# Altium project QLA.PrjPCB
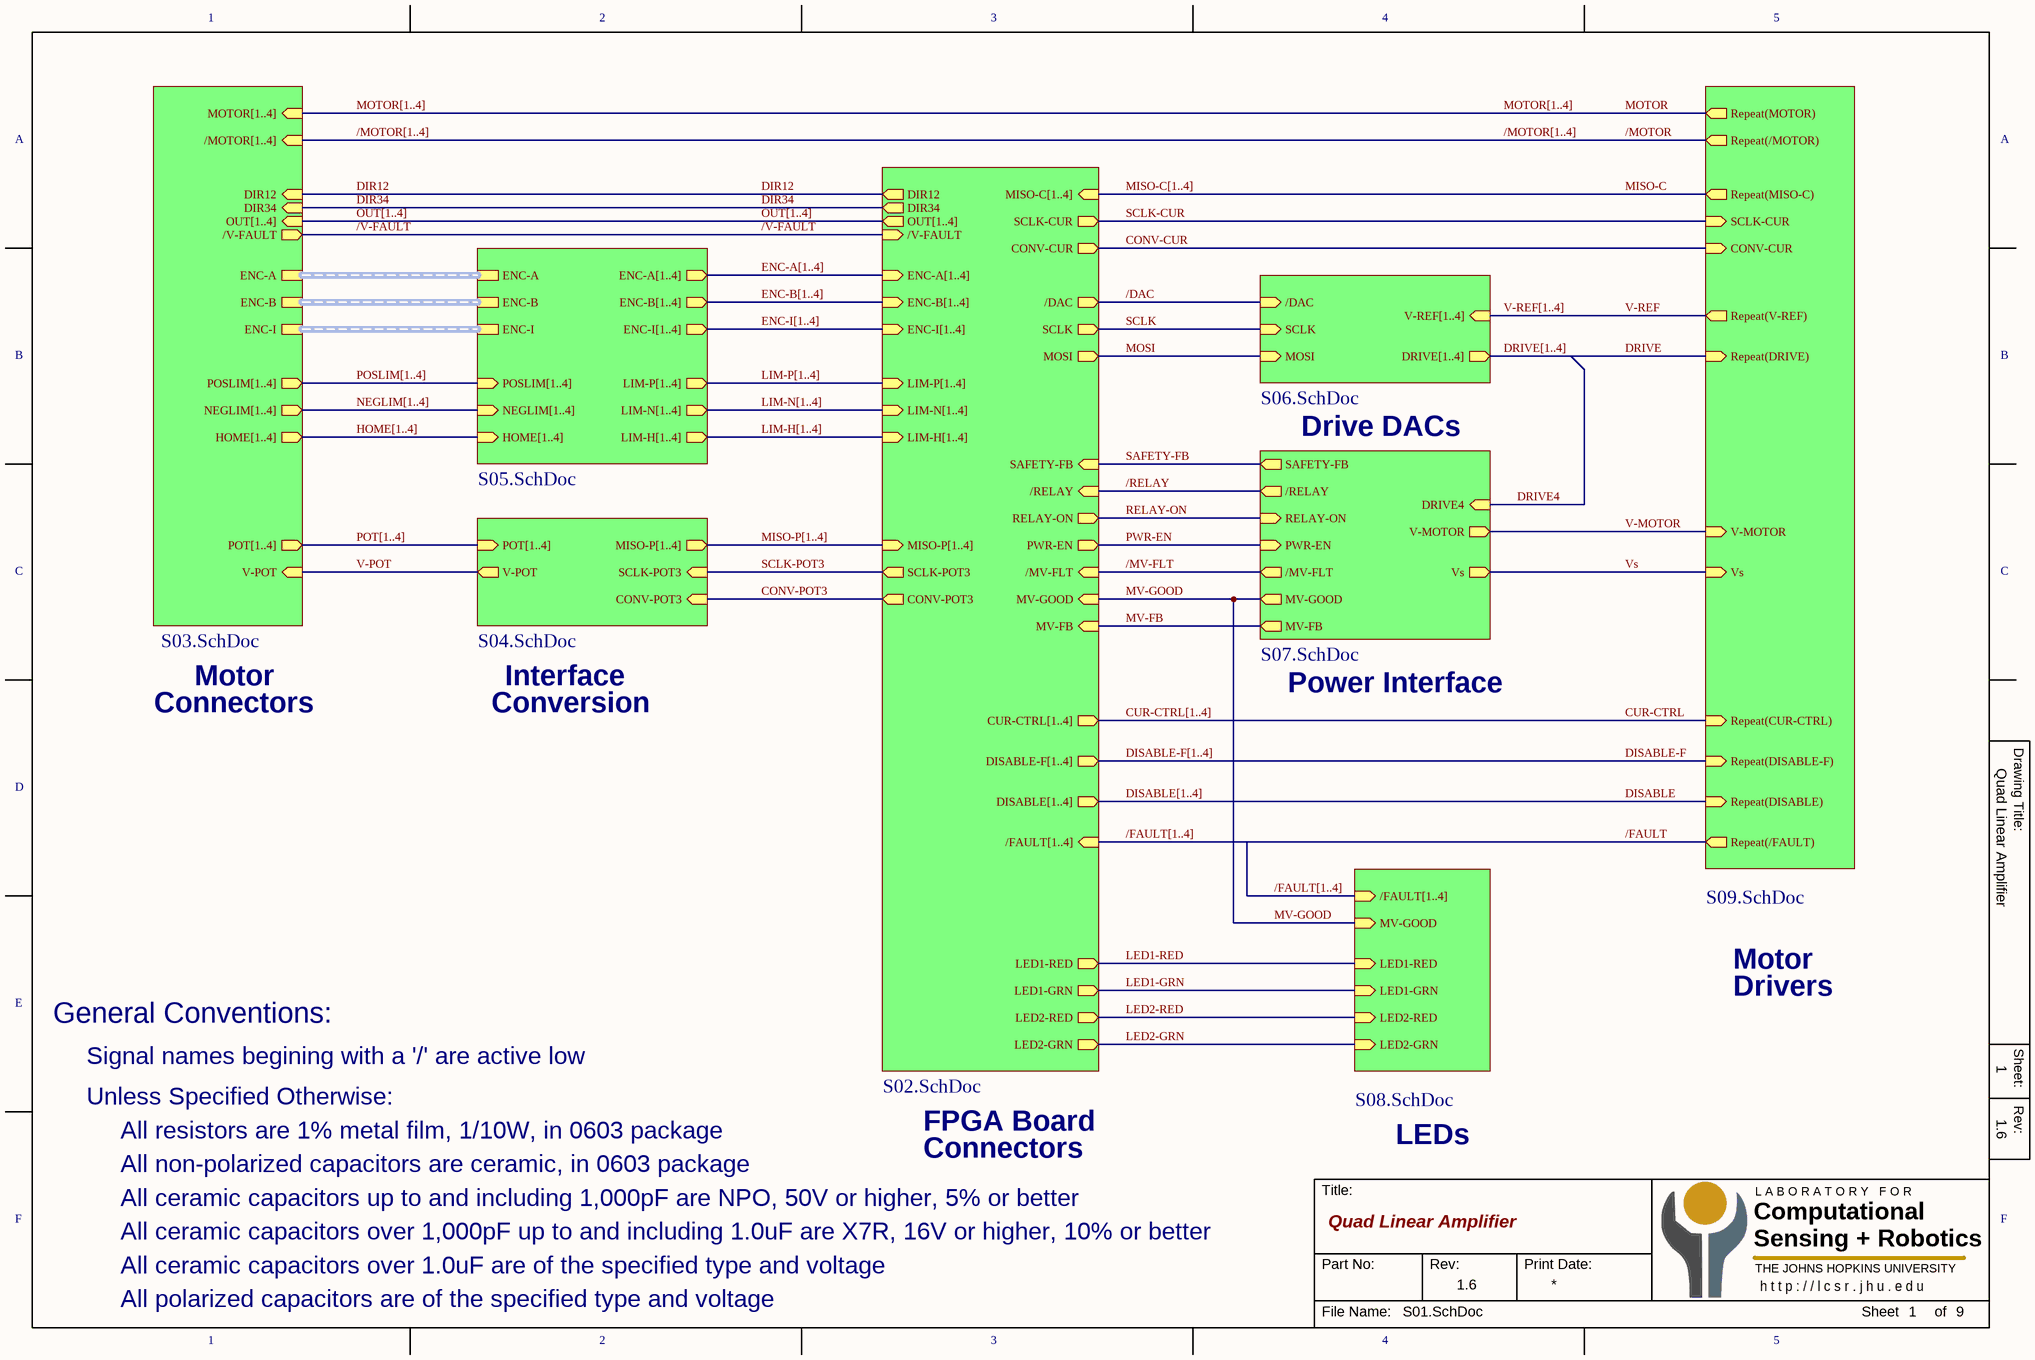
[diagram p0: S01.SchDoc]
9 sheets, 484 parts. Net scope: hierarchical (ports join the sheet entries above them; power ports are global).
Board file: AMP.PcbDoc
Sheets:
  S01.SchDoc
    U_S02 = S02.SchDoc
    U_S03 = S03.SchDoc
    U_S04 = S04.SchDoc
    U_S05 = S05.SchDoc
    U_S06 = S06.SchDoc
    U_S091 = S09.SchDoc
    U_S092 = S09.SchDoc
    U_S093 = S09.SchDoc
    U_S094 = S09.SchDoc
    U_S07 = S07.SchDoc
    U_S09 = S08.SchDoc

## Sheet S01.SchDoc: Quad Linear Amplifier
size 381 x 254 mm; Revision: 1.6; SheetNumber: 1; SheetTotal: 9

### Sub-sheets
Repeat(U_S09,1,4) = S09.SchDoc: Repeat(/MOTOR) (out), Repeat(MOTOR) (out), Repeat(DRIVE) (in), V-MOTOR (in), Repeat(DISABLE) (in), Repeat(/FAULT) (out), CONV-CUR (in), SCLK-CUR (in), Repeat(MISO-C) (out), Repeat(DISABLE-F) (in), Repeat(CUR-CTRL) (in), Vs (in), Repeat(V-REF) (out)
U_S02 = S02.SchDoc: /FAULT[1..4] (in), DISABLE[1..4] (out), LIM-P[1..4] (in), LIM-N[1..4] (in), LIM-H[1..4] (in), ENC-A[1..4] (in), ENC-B[1..4] (in), ENC-I[1..4] (in), OUT[1..4] (out), CONV-POT3 (out), SCLK-POT3 (out), MISO-P[1..4] (in), CONV-CUR (out), SCLK-CUR (out), MISO-C[1..4] (in), PWR-EN (out), MV-GOOD (in), /DAC (out), SCLK (out), MOSI (out), /V-FAULT (in), RELAY-ON (out), /RELAY (in), LED2-GRN (out), LED2-RED (out), LED1-GRN (out), LED1-RED (out), DIR34 (out), DIR12 (out), /MV-FLT (in), CUR-CTRL[1..4] (out), MV-FB (in), SAFETY-FB (in), DISABLE-F[1..4] (out)
U_S03 = S03.SchDoc: OUT[1..4] (in), POSLIM[1..4] (out), NEGLIM[1..4] (out), HOME[1..4] (out), POT[1..4] (out), V-POT (in), /MOTOR[1..4] (in), MOTOR[1..4] (in), ENC-A (harness ENC-A), ENC-B (harness ENC-B), ENC-I (harness ENC-I), /V-FAULT (out), DIR34 (in), DIR12 (in)
U_S04 = S04.SchDoc: CONV-POT3 (in), SCLK-POT3 (in), MISO-P[1..4] (out), V-POT (out), POT[1..4] (in)
U_S05 = S05.SchDoc: ENC-A[1..4] (out), ENC-B[1..4] (out), ENC-I[1..4] (out), ENC-A (harness ENC-A), ENC-B (harness ENC-B), ENC-I (harness ENC-I), POSLIM[1..4] (in), NEGLIM[1..4] (in), HOME[1..4] (in), LIM-P[1..4] (out), LIM-N[1..4] (out), LIM-H[1..4] (out)
U_S06 = S06.SchDoc: DRIVE[1..4] (out), /DAC (in), SCLK (in), MOSI (in), V-REF[1..4] (in)
U_S07 = S07.SchDoc: V-MOTOR (out), PWR-EN (in), MV-GOOD (out), RELAY-ON (in), /RELAY (out), /MV-FLT (out), MV-FB (out), SAFETY-FB (out), Vs (out), DRIVE4 (in)
U_S09 = S08.SchDoc: /FAULT[1..4] (in), MV-GOOD (in), LED2-GRN (in), LED2-RED (in), LED1-GRN (in), LED1-RED (in)

### Nets
/DAC: sheet U_S02//DAC, sheet U_S06//DAC
/FAULT: sheet Repeat(U_S09,1,4)/Repeat(/FAULT)
/MOTOR: sheet Repeat(U_S09,1,4)/Repeat(/MOTOR)
/MV-FLT: sheet U_S02//MV-FLT, sheet U_S07//MV-FLT
/RELAY: sheet U_S02//RELAY, sheet U_S07//RELAY
/V-FAULT: sheet U_S02//V-FAULT, sheet U_S03//V-FAULT
CONV-CUR: sheet U_S02/CONV-CUR, sheet Repeat(U_S09,1,4)/CONV-CUR
CONV-POT3: sheet U_S02/CONV-POT3, sheet U_S04/CONV-POT3
CUR-CTRL: sheet Repeat(U_S09,1,4)/Repeat(CUR-CTRL)
DIR12: sheet U_S02/DIR12, sheet U_S03/DIR12
DIR34: sheet U_S02/DIR34, sheet U_S03/DIR34
DISABLE: sheet Repeat(U_S09,1,4)/Repeat(DISABLE)
DISABLE-F: sheet Repeat(U_S09,1,4)/Repeat(DISABLE-F)
DRIVE: sheet Repeat(U_S09,1,4)/Repeat(DRIVE)
LED1-GRN: sheet U_S02/LED1-GRN, sheet U_S09/LED1-GRN
LED1-RED: sheet U_S02/LED1-RED, sheet U_S09/LED1-RED
LED2-GRN: sheet U_S02/LED2-GRN, sheet U_S09/LED2-GRN
LED2-RED: sheet U_S02/LED2-RED, sheet U_S09/LED2-RED
MISO-C: sheet Repeat(U_S09,1,4)/Repeat(MISO-C)
MOSI: sheet U_S02/MOSI, sheet U_S06/MOSI
MOTOR: sheet Repeat(U_S09,1,4)/Repeat(MOTOR)
MV-FB: sheet U_S02/MV-FB, sheet U_S07/MV-FB
MV-GOOD: sheet U_S02/MV-GOOD, sheet U_S07/MV-GOOD, sheet U_S09/MV-GOOD
PWR-EN: sheet U_S02/PWR-EN, sheet U_S07/PWR-EN
RELAY-ON: sheet U_S02/RELAY-ON, sheet U_S07/RELAY-ON
SAFETY-FB: sheet U_S02/SAFETY-FB, sheet U_S07/SAFETY-FB
SCLK: sheet U_S02/SCLK, sheet U_S06/SCLK
SCLK-CUR: sheet U_S02/SCLK-CUR, sheet Repeat(U_S09,1,4)/SCLK-CUR
SCLK-POT3: sheet U_S02/SCLK-POT3, sheet U_S04/SCLK-POT3
V-MOTOR: sheet Repeat(U_S09,1,4)/V-MOTOR, sheet U_S07/V-MOTOR
V-POT: sheet U_S03/V-POT, sheet U_S04/V-POT
V-REF: sheet Repeat(U_S09,1,4)/Repeat(V-REF)
Vs: sheet Repeat(U_S09,1,4)/Vs, sheet U_S07/Vs

### Buses and harness runs
bus /FAULT[1..4] = sheet U_S02//FAULT[1..4] = sheet U_S09//FAULT[1..4]
bus /MOTOR[1..4] = sheet U_S03//MOTOR[1..4]
bus CUR-CTRL[1..4] = sheet U_S02/CUR-CTRL[1..4]
bus DISABLE-F[1..4] = sheet U_S02/DISABLE-F[1..4]
bus DISABLE[1..4] = sheet U_S02/DISABLE[1..4]
bus DRIVE[1..4] = sheet U_S06/DRIVE[1..4]
bus ENC-A[1..4] = sheet U_S02/ENC-A[1..4] = sheet U_S05/ENC-A[1..4]
bus ENC-B[1..4] = sheet U_S02/ENC-B[1..4] = sheet U_S05/ENC-B[1..4]
bus ENC-I[1..4] = sheet U_S02/ENC-I[1..4] = sheet U_S05/ENC-I[1..4]
bus HOME[1..4] = sheet U_S03/HOME[1..4] = sheet U_S05/HOME[1..4]
bus LIM-H[1..4] = sheet U_S02/LIM-H[1..4] = sheet U_S05/LIM-H[1..4]
bus LIM-N[1..4] = sheet U_S02/LIM-N[1..4] = sheet U_S05/LIM-N[1..4]
bus LIM-P[1..4] = sheet U_S02/LIM-P[1..4] = sheet U_S05/LIM-P[1..4]
bus MISO-C[1..4] = sheet U_S02/MISO-C[1..4]
bus MISO-P[1..4] = sheet U_S02/MISO-P[1..4] = sheet U_S04/MISO-P[1..4]
bus MOTOR[1..4] = sheet U_S03/MOTOR[1..4]
bus NEGLIM[1..4] = sheet U_S03/NEGLIM[1..4] = sheet U_S05/NEGLIM[1..4]
bus OUT[1..4] = sheet U_S02/OUT[1..4] = sheet U_S03/OUT[1..4]
bus POSLIM[1..4] = sheet U_S03/POSLIM[1..4] = sheet U_S05/POSLIM[1..4]
bus POT[1..4] = sheet U_S03/POT[1..4] = sheet U_S04/POT[1..4]
bus V-REF[1..4] = sheet U_S06/V-REF[1..4]
harness sheet U_S03/ENC-A = sheet U_S05/ENC-A
harness sheet U_S03/ENC-B = sheet U_S05/ENC-B
harness sheet U_S03/ENC-I = sheet U_S05/ENC-I

### Notes on the sheet
- Drive DACs
- Motor
- Interface
- Power Interface
- Connectors
- Conversion
- General Conventions:
- Drivers
- Signal names begining with a '/' are active low
- Unless Specified Otherwise:
- All resistors are 1% metal film, 1/10W, in 0603 package
- All non-polarized capacitors are ceramic, in 0603 package
- FPGA Board
- LEDs
- All ceramic capacitors up to and including 1,000pF are NPO, 50V or higher, 5% or better
- All ceramic capacitors over 1,000pF up to and including 1.0uF are X7R, 16V or higher, 10% or better
- All ceramic capacitors over 1.0uF are of the specified type and voltage
- All polarized capacitors are of the specified type and voltage
- 1
- 2
- 3
- 4
- 5
- A
- B
- C
- Drawing Title:
- D
- E
- Sheet:
- Rev:
- F
- Title:
- Computational
- Sensing + Robotics
- L A B O R A T O R Y   F O R
- Part No:
- Print Date:
- THE JOHNS HOPKINS UNIVERSITY
- h t t p : / / l c s r . j h u . e d u
- File Name:
- Sheet
- of

## Sheet S02.SchDoc: Quad Linear Amplifier
size 381 x 254 mm; Revision: 1.6; SheetNumber: 2; SheetTotal: 9; PageSetup: Record=PageOptions|CenterHorizontal=True|CenterVertical=True|PrintScale=0.72|XCorrection=1.00|YCorrection=1.00|PrintKind=1|BorderSize=5000000|LeftOffset=0|BottomOffset=0|Orientation=2|PaperLength=1000|PaperWidth=1000|Scale=100|PaperSource=7|PrintQuality=1200|MediaType=1|DitherType=10|PaperKind=Letter|PrintScaleMode=1
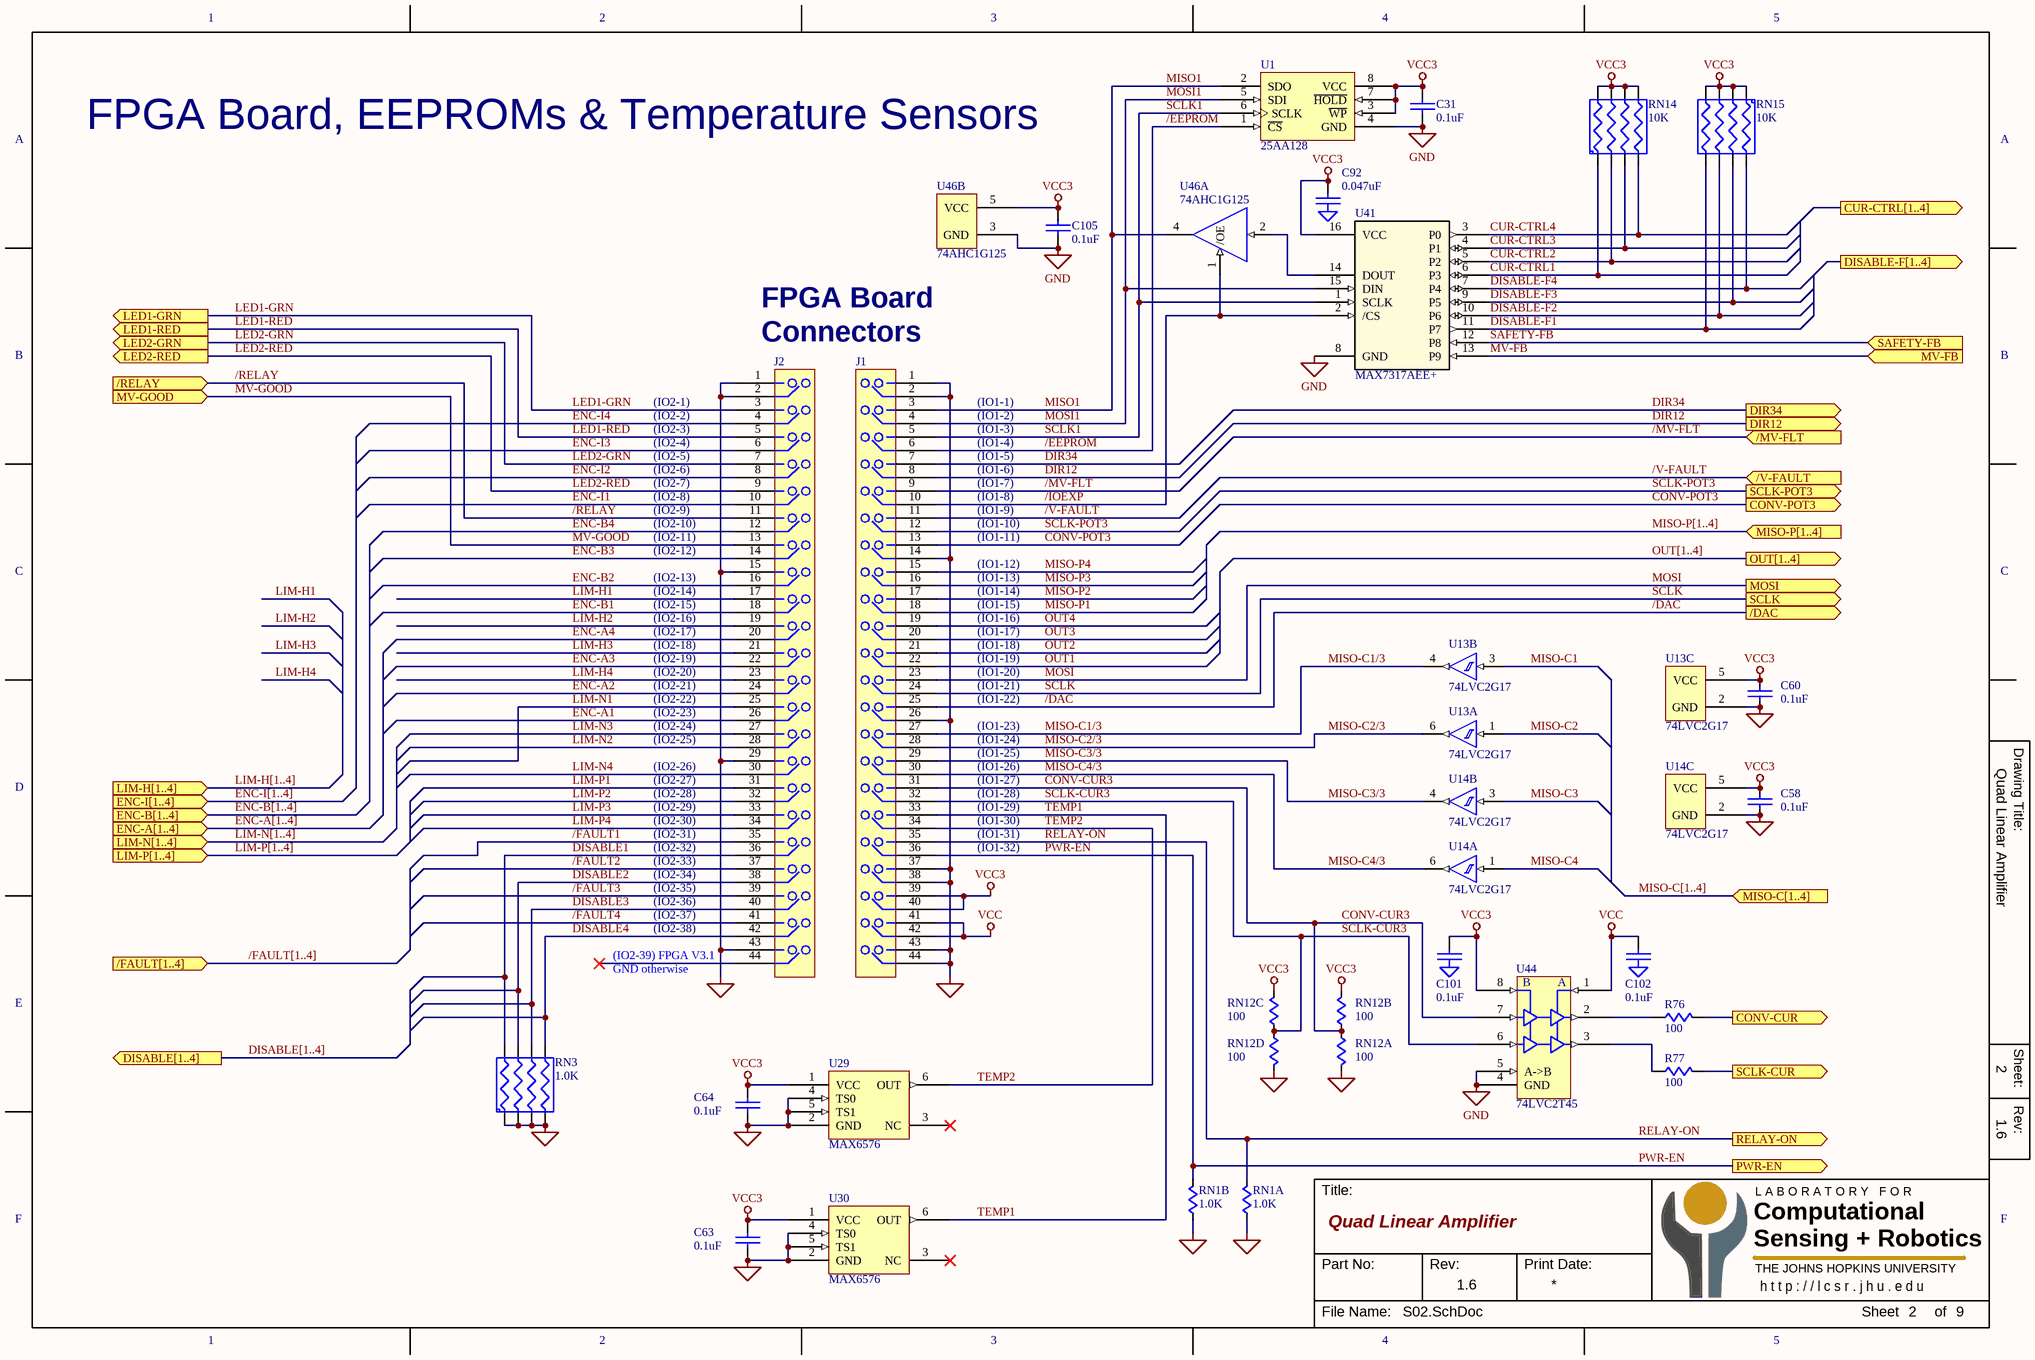
[diagram p1: S02.SchDoc]

### Parts
C31  0.1uF  [C0603]
C58  0.1uF  [C0603]
C60  0.1uF  [C0603]
C63  0.1uF  [C0603]
C64  0.1uF  [C0603]
C92  0.047uF  [C0603]
C101  0.1uF  [C0603]
C102  0.1uF  [C0603]
C105  0.1uF  [C0603]
J1  HEADER 22x2-1  [HDR-22x2-2MM]  (value not drawn)
J2  HEADER 22x2-1  [HDR-22x2-2MM]  (value not drawn)
R76  100  [R0603]
R77  100  [R0603]
RN1  1.0K  [RN-742C083]  (parts A,B of 4)
RN3  1.0K  [RN-742C083]
RN12  100  [RN-742C083]  (parts A,B,C,D of 4)
RN14  10K  [RN-742C083]
RN15  10K  [RN-742C083]
U1  25AA128  [TSSOP-8]
U13  74LVC2G17  [SOT-23-6]  (parts A,B,C of 3)
U14  74LVC2G17  [SOT-23-6]  (parts A,B,C of 3)
U29  MAX6576  [SOT-23-6]
U30  MAX6576  [SOT-23-6]
U41  MAX7317AEE+  [QSOP-16]
U44  74LVC2T45  [US8-8]
U46  74AHC1G125  [SOT-23-5]  (parts A,B of 2)

### Ports
/DAC (out), /FAULT[1..4] (in), /MV-FLT (in), /RELAY (in), /V-FAULT (in), CONV-CUR (out), CONV-POT3 (out), CUR-CTRL[1..4] (out), DIR12 (out), DIR34 (out), DISABLE-F[1..4] (out), DISABLE[1..4] (out), ENC-A[1..4] (in), ENC-B[1..4] (in), ENC-I[1..4] (in), LED1-GRN (out), LED1-RED (out), LED2-GRN (out), LED2-RED (out), LIM-H[1..4] (in), LIM-N[1..4] (in), LIM-P[1..4] (in), MISO-C[1..4] (in), MISO-P[1..4] (in), MOSI (out), MV-FB (in), MV-GOOD (in), OUT[1..4] (out), PWR-EN (out), RELAY-ON (out), SAFETY-FB (in), SCLK (out), SCLK-CUR (out), SCLK-POT3 (out)

### Nets
GND: C31.2 C58.2 C60.2 C63.2 C64.2 C92.2(GND) C101.2(GND) C102.2(GND) C105.2 J1.1 J1.2 J1.14 J1.26 J1.37 J1.38 J1.43 J1.44 J2.1 J2.2 J2.15 J2.29 J2.43 RN1.1 RN1.2 RN3.1(R1) RN3.2(R2.1) RN3.3(R3.1) RN3.4(R4.1) RN12.5 RN12.8 U1.4(GND) U13.2(GND) U14.2(GND) U29.2(GND) U29.4(TS0) U29.5(TS1) U30.2(GND) U30.4(TS0) U30.5(TS1) U41.8(GND) U44.4(GND) U44.5(A->B) U46.3(GND)
VCC: C102.1 J1.41 J1.42 U44.1(VCCA)
VCC3: C31.1 C58.1 C60.1 C63.1 C64.1 C92.1 C101.1 C105.1 J1.39 J1.40 RN12.6 RN12.7 RN14.5(R4.2) RN14.6(R3.2) RN14.7(R2.2) RN14.8(R1.2) RN15.1(R1) RN15.2(R2.1) RN15.3(R3.1) RN15.4(R4.1) U1.3(~{WP}) U1.7(~{HOLD}) U1.8(VCC) U13.5(VCC) U14.5(VCC) U29.1(VCC) U30.1(VCC) U41.16(VCC) U44.8(VCCB) U46.5(VCC)
/DAC: J1.25 ; port /DAC
/EEPROM: J1.6 U1.1(~{CS})
/FAULT1: J2.35  [project net /FAULT]
/FAULT2: J2.37  [project net /FAULT]
/FAULT3: J2.39  [project net /FAULT]
/FAULT4: J2.41  [project net /FAULT]
/IOEXP: J1.10 U41.2(/CS) U46.1(/OE)
/MV-FLT: J1.9 ; port /MV-FLT
/RELAY: J2.11 ; port /RELAY
/V-FAULT: J1.11 ; port /V-FAULT
CONV-CUR: R76.2 ; port CONV-CUR
CONV-CUR3: J1.31 RN12.1 RN12.2 U44.7(B)
CONV-POT3: J1.13 ; port CONV-POT3
CUR-CTRL1: RN14.1(R1) U41.6(P3)
CUR-CTRL2: RN14.2(R2.1) U41.5(P2)
CUR-CTRL3: RN14.3(R3.1) U41.4(P1)
CUR-CTRL4: RN14.4(R4.1) U41.3(P0)
DIR12: J1.8 ; port DIR12
DIR34: J1.7 ; port DIR34
DISABLE1: J2.36 RN3.8(R1.2)  [project net DISABLE]
DISABLE2: J2.38 RN3.7(R2.2)  [project net DISABLE]
DISABLE3: J2.40 RN3.6(R3.2)  [project net DISABLE]
DISABLE4: J2.42 RN3.5(R4.2)  [project net DISABLE]
DISABLE-F1: RN15.5(R4.2) U41.11(P7)
DISABLE-F2: RN15.6(R3.2) U41.10(P6)
DISABLE-F3: RN15.7(R2.2) U41.9(P5)
DISABLE-F4: RN15.8(R1.2) U41.7(P4)
ENC-A1: J2.26
ENC-A2: J2.24
ENC-A3: J2.22
ENC-A4: J2.20
ENC-B1: J2.18
ENC-B2: J2.16
ENC-B3: J2.14
ENC-B4: J2.12
ENC-I1: J2.10
ENC-I2: J2.8
ENC-I3: J2.6
ENC-I4: J2.4
LED1-GRN: J2.3 ; port LED1-GRN
LED1-RED: J2.5 ; port LED1-RED
LED2-GRN: J2.7 ; port LED2-GRN
LED2-RED: J2.9 ; port LED2-RED
LIM-H1: J2.17
LIM-H2: J2.19
LIM-H3: J2.21
LIM-H4: J2.23
LIM-N1: J2.25
LIM-N2: J2.28
LIM-N3: J2.27
LIM-N4: J2.30
LIM-P1: J2.31
LIM-P2: J2.32
LIM-P3: J2.33
LIM-P4: J2.34
MISO1: J1.3 U1.2(SDO) U46.4(Y)
MISO-C1: U13.3  [project net MISO-C]
MISO-C1/3: J1.27 U13.4
MISO-C2: U13.1  [project net MISO-C]
MISO-C2/3: J1.28 U13.6
MISO-C3: U14.3  [project net MISO-C]
MISO-C3/3: J1.29 U14.4
MISO-C4: U14.1  [project net MISO-C]
MISO-C4/3: J1.30 U14.6
MISO-P1: J1.18
MISO-P2: J1.17
MISO-P3: J1.16
MISO-P4: J1.15
MOSI: J1.23 ; port MOSI
MOSI1: J1.4 U1.5(SDI) U41.15(DIN)
MV-FB: U41.13(P9) ; port MV-FB
MV-GOOD: J2.13 ; port MV-GOOD
OUT1: J1.22
OUT2: J1.21
OUT3: J1.20
OUT4: J1.19
PWR-EN: J1.36 RN1.7 ; port PWR-EN
RELAY-ON: J1.35 RN1.8 ; port RELAY-ON
SAFETY-FB: U41.12(P8) ; port SAFETY-FB
SCLK: J1.24 ; port SCLK
SCLK1: J1.5 U1.6(SCLK) U41.1(SCLK)
SCLK-CUR: R77.2 ; port SCLK-CUR
SCLK-CUR3: J1.32 RN12.3 RN12.4 U44.6(B)
SCLK-POT3: J1.12 ; port SCLK-POT3
TEMP1: J1.33 U30.6(OUT)
TEMP2: J1.34 U29.6(OUT)
NetR76_1: R76.1 U44.2(A)
NetR77_1: R77.1 U44.3(A)
NetU41_14: U41.14(DOUT) U46.2(A)

Not connected (* = marked no-connect by the designer): J2 44*; U29 3(NC)*; U30 3(NC)*

### Buses and harness runs
bus /FAULT[1..4] = port /FAULT[1..4]
bus DISABLE[1..4] = port DISABLE[1..4]
bus ENC-A[1..4] = port ENC-A[1..4]
bus ENC-B[1..4] = port ENC-B[1..4]
bus ENC-I[1..4] = port ENC-I[1..4]
bus LIM-H[1..4] = port LIM-H[1..4]
bus LIM-N[1..4] = port LIM-N[1..4]
bus LIM-P[1..4] = port LIM-P[1..4]
bus MISO-C[1..4] = port MISO-C[1..4]
bus MISO-P[1..4] = port MISO-P[1..4]
bus OUT[1..4] = port OUT[1..4]

### Notes on the sheet
- FPGA Board, EEPROMs & Temperature Sensors
- FPGA Board
- Connectors
- (IO2-1)
- (IO2-2)
- (IO2-3)
- (IO1-1)
- (IO1-2)
- (IO1-3)
- (IO2-4)
- (IO2-5)
- (IO2-6)
- (IO2-7)
- (IO2-8)
- (IO1-4)
- (IO1-5)
- (IO1-6)
- (IO1-7)
- (IO1-8)
- (IO2-9)
- (IO2-10)
- (IO2-11)
- (IO2-12)
- (IO1-9)
- (IO1-10)
- (IO1-11)
- (IO1-12)
- (IO2-13)
- (IO2-14)
- (IO2-15)
- (IO2-16)
- (IO2-17)
- (IO1-13)
- (IO1-14)
- (IO1-15)
- (IO1-16)
- (IO1-17)
- (IO2-18)
- (IO2-19)
- (IO2-20)
- (IO2-21)
- (IO2-22)
- (IO1-18)
- (IO1-19)
- (IO1-20)
- (IO1-21)
- (IO1-22)
- (IO2-23)
- (IO2-24)
- (IO2-25)
- (IO2-26)
- (IO1-23)
- (IO1-24)
- (IO1-25)
- (IO1-26)
- (IO2-27)
- (IO2-28)
- (IO2-29)
- (IO2-30)
- (IO2-31)
- (IO1-27)
- (IO1-28)
- (IO1-29)
- (IO1-30)
- (IO1-31)
- (IO2-32)
- (IO2-33)
- (IO2-34)
- (IO2-35)
- (IO2-36)
- (IO1-32)
- (near J2) (IO2-39) FPGA V3.1
- GND otherwise
- (IO2-37)
- (IO2-38)
- 1
- 2
- 3
- 4
- 5
- A
- B
- C
- Drawing Title:
- D
- E
- Sheet:
- Rev:
- F
- Title:
- Computational
- Sensing + Robotics
- L A B O R A T O R Y   F O R
- Part No:
- Print Date:
- THE JOHNS HOPKINS UNIVERSITY
- h t t p : / / l c s r . j h u . e d u
- File Name:
- Sheet
- of

### Library data of the parts
C31 C63 C64 C105 = CAP
C58 C60 = CAP-MINI
C92 C101 C102 = CAP-GND
R76 R77 = R
RN1 RN12 = RN-DISC-SM-4X
RN3 RN14 RN15 = RN-DISC-SM-4
U13 U14 = 2G17: NC7WZ17
U41 = MAX7317AEE+: SourceLibrary: Maxim_2011-10-27; Built_By: EMA_UL_Team; Vendor: Maxim Integrated Products; Revision: 1; Manufacturer_Part_Number: MAX7317AEE+; Copyright: Copyright (C) 2021 Accelerated Designs. All rights reserved; RefDes: RefDes; Type: DEV

## Sheet S03.SchDoc: Quad Linear Amplifier
size 381 x 254 mm; Revision: 1.6; SheetNumber: 3; SheetTotal: 9
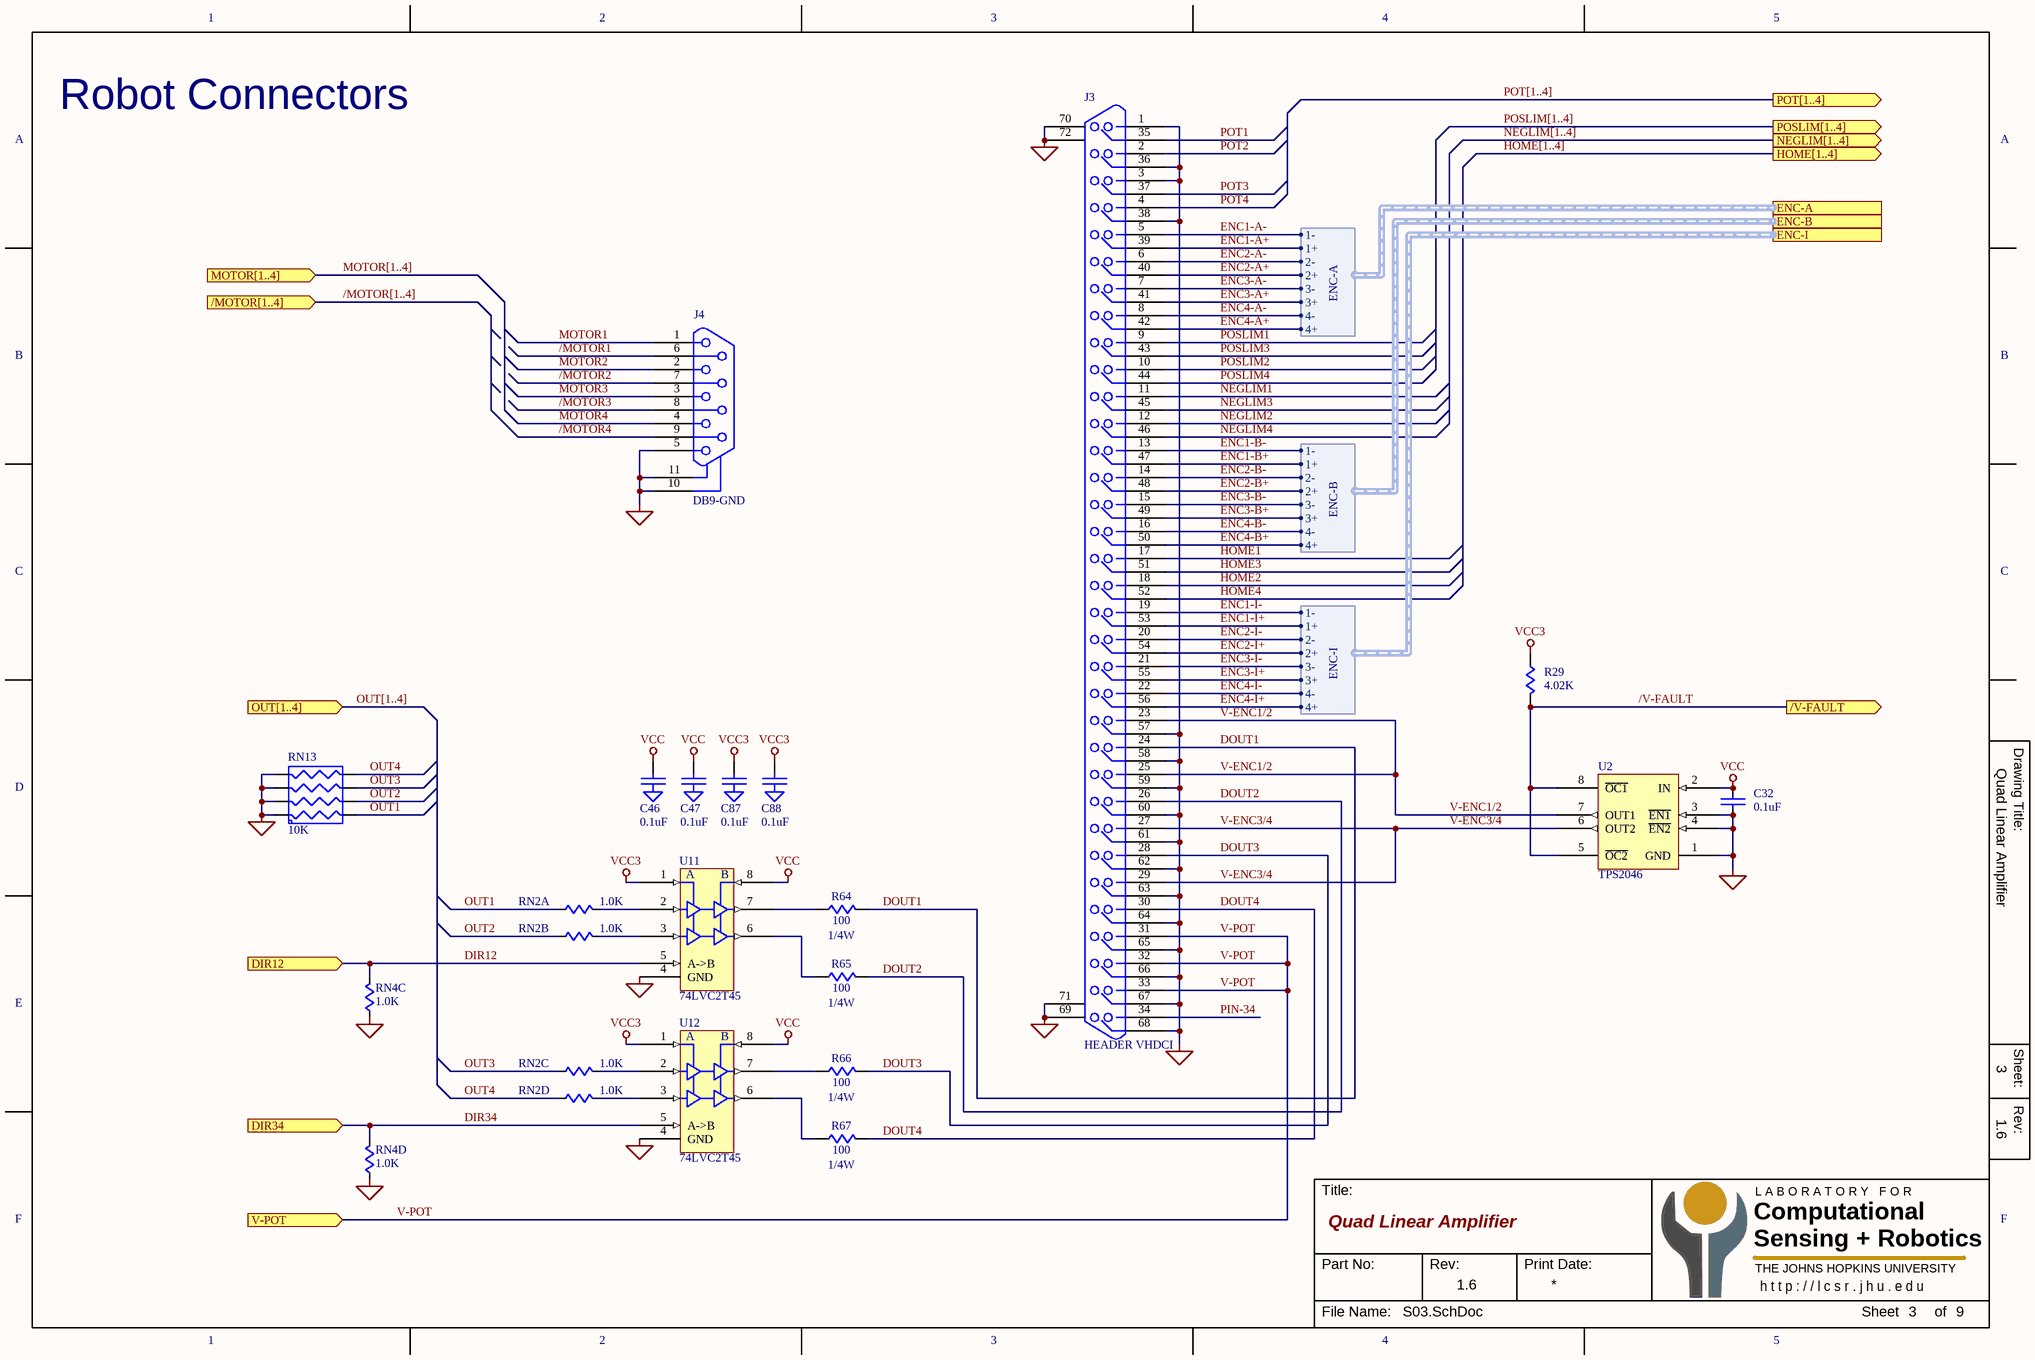
[diagram p2: S03.SchDoc]

### Parts
C32  0.1uF  [C0603]
C46  0.1uF  [C0603]
C47  0.1uF  [C0603]
C87  0.1uF  [C0603]
C88  0.1uF  [C0603]
J3  HEADER VHDCI  [CONN-VHDCI]
J4  DB9-GND  [DB9F/RA-545-HDP]
R29  4.02K  [R0603]
R64  100  [R1206]
R65  100  [R1206]
R66  100  [R1206]
R67  100  [R1206]
RN2  1.0K  [RN-742C083]  (parts A,B,C,D of 4)
RN4  1.0K  [RN-742C083]  (parts C,D of 4)
RN13  10K  [RN-742C083]
U2  TPS2046  [SO-8]
U11  74LVC2T45  [US8-8]
U12  74LVC2T45  [US8-8]

### Ports
/MOTOR[1..4] (in), /V-FAULT (out), DIR12 (in), DIR34 (in), ENC-A (harness ENC-A), ENC-B (harness ENC-B), ENC-I (harness ENC-I), HOME[1..4] (out), MOTOR[1..4] (in), NEGLIM[1..4] (out), OUT[1..4] (in), POSLIM[1..4] (out), POT[1..4] (out), V-POT (in)

### Harnesses
ENC-A: 1-, 1+, 2-, 2+, 3-, 3+, 4-, 4+
ENC-B: 1-, 1+, 2-, 2+, 3-, 3+, 4-, 4+
ENC-I: 1-, 1+, 2-, 2+, 3-, 3+, 4-, 4+

### Nets
GND: C32.2 C46.2(GND) C47.2(GND) C87.2(GND) C88.2(GND) J3.1 J3.3 J3.36 J3.38 J3.57 J3.58 J3.59 J3.60 J3.61 J3.62 J3.63 J3.64 J3.65 J3.66 J3.67 J3.68 J3.69 J3.70 J3.71 J3.72 J4.5 J4.10(GND) J4.11(GND) RN4.3 RN4.4 RN13.1(R1) RN13.2(R2.1) RN13.3(R3.1) RN13.4(R4.1) U2.1(GND) U2.3(~{EN1}) U2.4(~{EN2}) U11.4(GND) U12.4(GND)
VCC: C32.1 C46.1 C47.1 U2.2(IN) U11.8(VCCB) U12.8(VCCB)
VCC3: C87.1 C88.1 R29.1 U11.1(VCCA) U12.1(VCCA)
/MOTOR1: J4.6  [project net /MOTOR]
/MOTOR2: J4.7  [project net /MOTOR]
/MOTOR3: J4.8  [project net /MOTOR]
/MOTOR4: J4.9  [project net /MOTOR]
/V-FAULT: R29.2 U2.5(~{OC2}) U2.8(~{OC1}) ; port /V-FAULT
DIR12: RN4.6 U11.5(A->B) ; port DIR12
DIR34: RN4.5 U12.5(A->B) ; port DIR34
DOUT1: J3.24 R64.2
DOUT2: J3.26 R65.2
DOUT3: J3.28 R66.2
DOUT4: J3.30 R67.2
ENC1-A+: J3.39 ; port ENC-A.1+
ENC1-A-: J3.5 ; port ENC-A.1-
ENC1-B+: J3.47 ; port ENC-B.1+
ENC1-B-: J3.13 ; port ENC-B.1-
ENC1-I+: J3.53 ; port ENC-I.1+
ENC1-I-: J3.19 ; port ENC-I.1-
ENC2-A+: J3.40 ; port ENC-A.2+
ENC2-A-: J3.6 ; port ENC-A.2-
ENC2-B+: J3.48 ; port ENC-B.2+
ENC2-B-: J3.14 ; port ENC-B.2-
ENC2-I+: J3.54 ; port ENC-I.2+
ENC2-I-: J3.20 ; port ENC-I.2-
ENC3-A+: J3.41 ; port ENC-A.3+
ENC3-A-: J3.7 ; port ENC-A.3-
ENC3-B+: J3.49 ; port ENC-B.3+
ENC3-B-: J3.15 ; port ENC-B.3-
ENC3-I+: J3.55 ; port ENC-I.3+
ENC3-I-: J3.21 ; port ENC-I.3-
ENC4-A+: J3.42 ; port ENC-A.4+
ENC4-A-: J3.8 ; port ENC-A.4-
ENC4-B+: J3.50 ; port ENC-B.4+
ENC4-B-: J3.16 ; port ENC-B.4-
ENC4-I+: J3.56 ; port ENC-I.4+
ENC4-I-: J3.22 ; port ENC-I.4-
HOME1: J3.17
HOME2: J3.18
HOME3: J3.51
HOME4: J3.52
MOTOR1: J4.1  [project net MOTOR]
MOTOR2: J4.2  [project net MOTOR]
MOTOR3: J4.3  [project net MOTOR]
MOTOR4: J4.4  [project net MOTOR]
NEGLIM1: J3.11
NEGLIM2: J3.12
NEGLIM3: J3.45
NEGLIM4: J3.46
OUT1: RN2.1 RN13.8(R1.2)
OUT2: RN2.2 RN13.7(R2.2)
OUT3: RN2.3 RN13.6(R3.2)
OUT4: RN2.4 RN13.5(R4.2)
PIN-34: J3.34
POSLIM1: J3.9
POSLIM2: J3.10
POSLIM3: J3.43
POSLIM4: J3.44
POT1: J3.35
POT2: J3.2
POT3: J3.37
POT4: J3.4
V-ENC1/2: J3.23 J3.25 U2.7(OUT1)
V-ENC3/4: J3.27 J3.29 U2.6(OUT2)
V-POT: J3.31 J3.32 J3.33 ; port V-POT
NetR64_1: R64.1 U11.7(B)
NetR65_1: R65.1 U11.6(B)
NetR66_1: R66.1 U12.7(B)
NetR67_1: R67.1 U12.6(B)
NetRN2_5: RN2.5 U12.3(A)
NetRN2_6: RN2.6 U12.2(A)
NetRN2_7: RN2.7 U11.3(A)
NetRN2_8: RN2.8 U11.2(A)

### Buses and harness runs
bus /MOTOR[1..4] = port /MOTOR[1..4]
bus HOME[1..4] = port HOME[1..4]
bus MOTOR[1..4] = port MOTOR[1..4]
bus NEGLIM[1..4] = port NEGLIM[1..4]
bus OUT[1..4] = port OUT[1..4]
bus POSLIM[1..4] = port POSLIM[1..4]
bus POT[1..4] = port POT[1..4]

### Notes on the sheet
- Robot Connectors
- 1
- 2
- 3
- 4
- 5
- A
- B
- C
- Drawing Title:
- D
- E
- Sheet:
- Rev:
- F
- Title:
- Computational
- Sensing + Robotics
- L A B O R A T O R Y   F O R
- Part No:
- Print Date:
- THE JOHNS HOPKINS UNIVERSITY
- h t t p : / / l c s r . j h u . e d u
- File Name:
- Sheet
- of
- (in symbol R) 1/4W

### Library data of the parts
C32 = CAP-MINI
C46 C47 C87 C88 = CAP-GND
J3 = HEADER VHDCI: Molex Part #71430-0008
R29 R64-R67 = R
RN2 RN4 = RN-DISC-SM-4X
RN13 = RN-DISC-SM-4

## Sheet S04.SchDoc: Quad Linear Amplifier
size 381 x 254 mm; Revision: 1.6; SheetNumber: 4; SheetTotal: 9
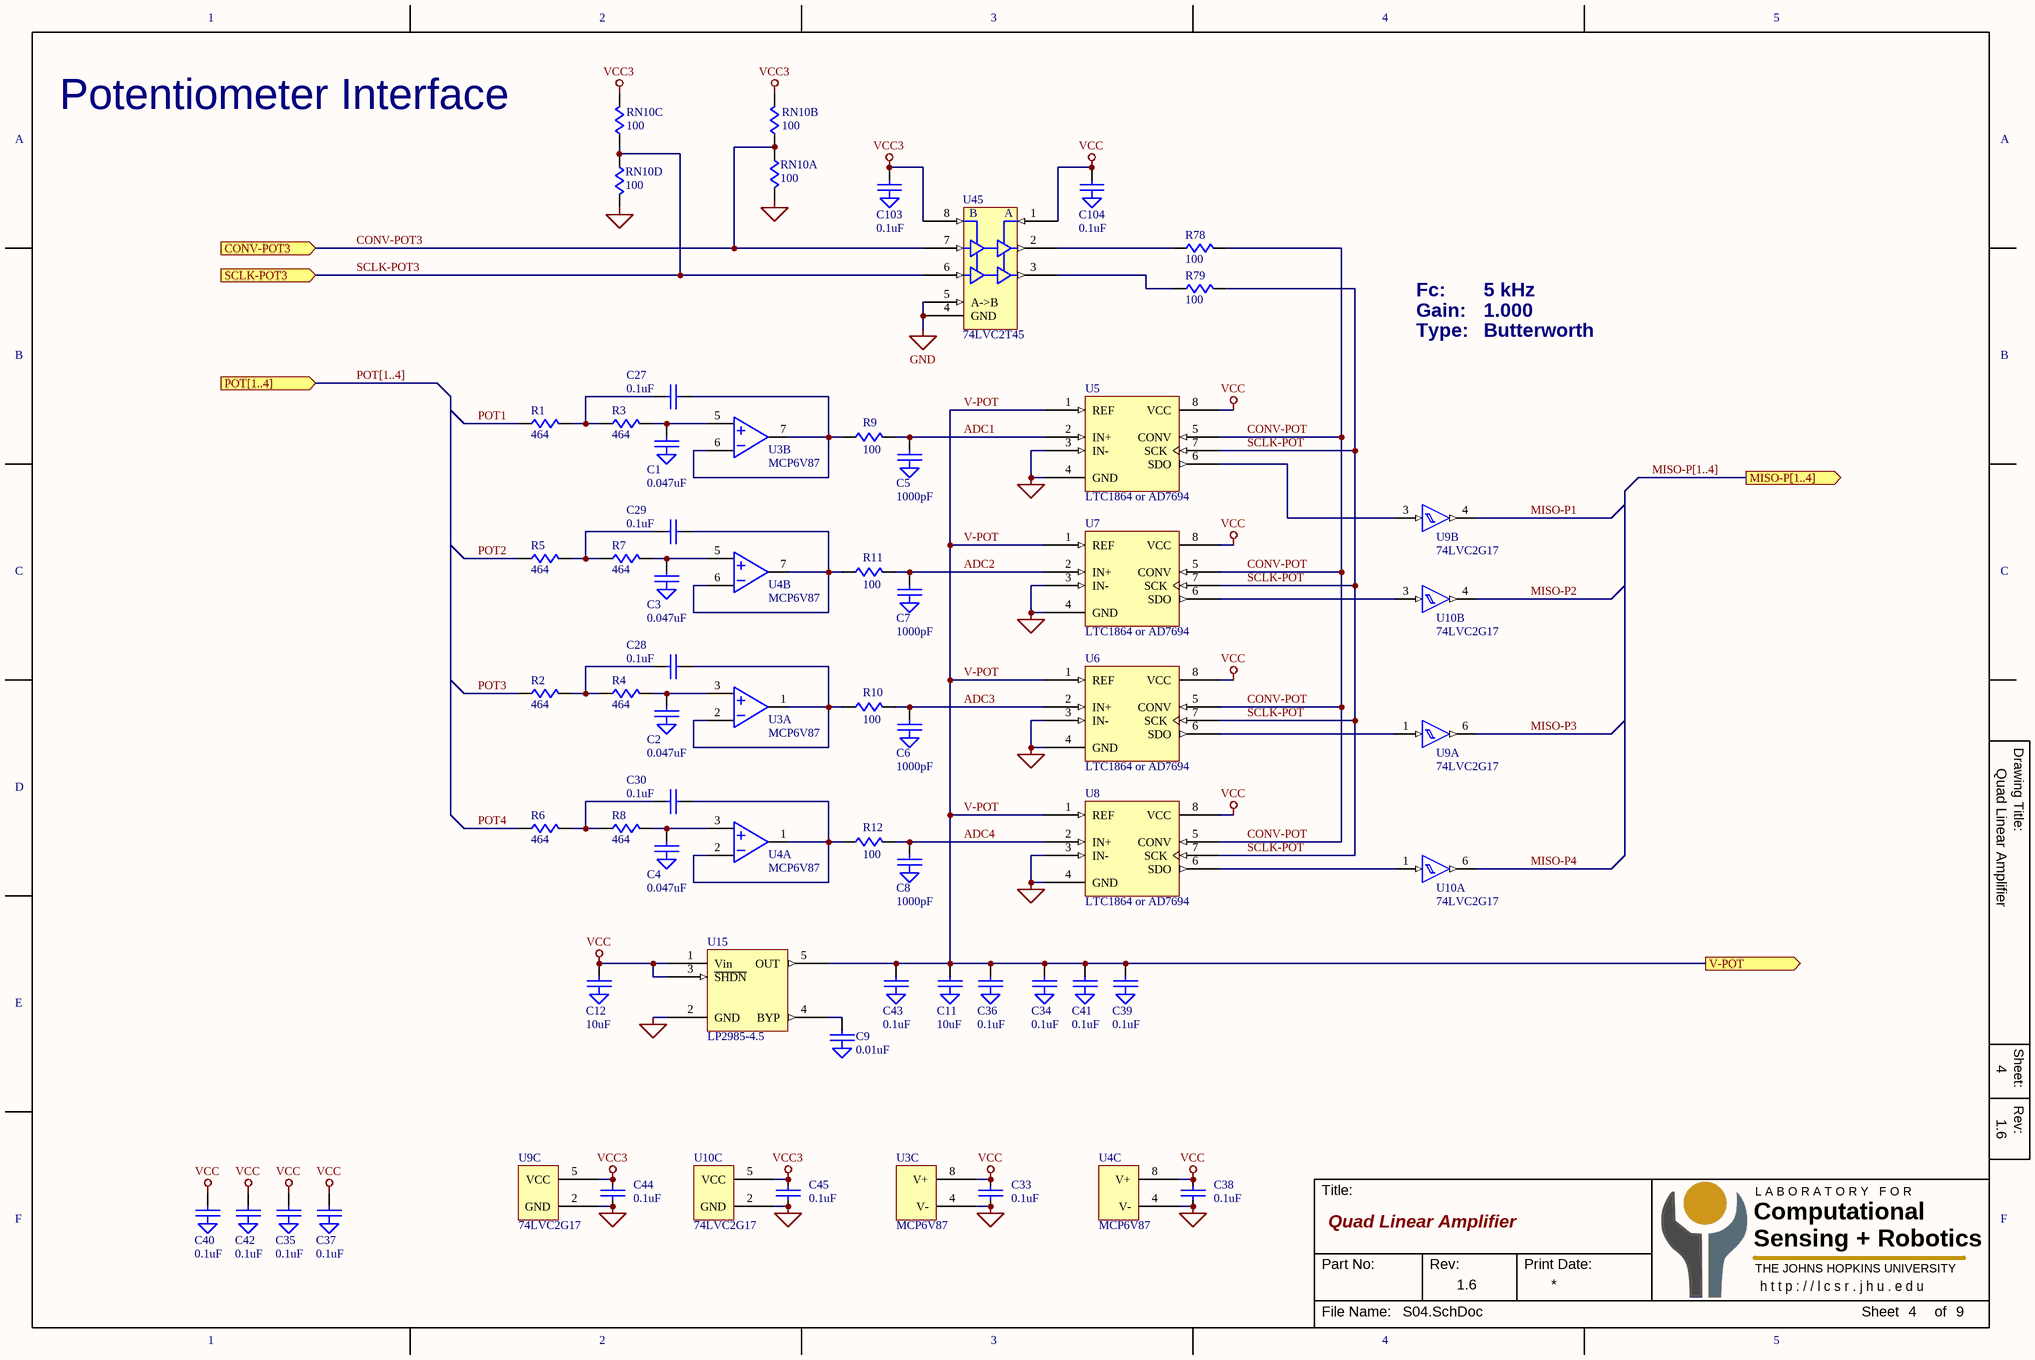
[diagram p3: S04.SchDoc]

### Parts
C1  0.047uF  [C0603]
C2  0.047uF  [C0603]
C3  0.047uF  [C0603]
C4  0.047uF  [C0603]
C5  1000pF  [C0603]
C6  1000pF  [C0603]
C7  1000pF  [C0603]
C8  1000pF  [C0603]
C9  0.01uF  [C0603]
C11  10uF  [C0603]
C12  10uF  [C0603]
C27  0.1uF  [C0603]
C28  0.1uF  [C0603]
C29  0.1uF  [C0603]
C30  0.1uF  [C0603]
C33  0.1uF  [C0603]
C34  0.1uF  [C0603]
C35  0.1uF  [C0603]
C36  0.1uF  [C0603]
C37  0.1uF  [C0603]
C38  0.1uF  [C0603]
C39  0.1uF  [C0603]
C40  0.1uF  [C0603]
C41  0.1uF  [C0603]
C42  0.1uF  [C0603]
C43  0.1uF  [C0603]
C44  0.1uF  [C0603]
C45  0.1uF  [C0603]
C103  0.1uF  [C0603]
C104  0.1uF  [C0603]
R1  464  [R0603]
R2  464  [R0603]
R3  464  [R0603]
R4  464  [R0603]
R5  464  [R0603]
R6  464  [R0603]
R7  464  [R0603]
R8  464  [R0603]
R9  100  [R0603]
R10  100  [R0603]
R11  100  [R0603]
R12  100  [R0603]
R78  100  [R0603]
R79  100  [R0603]
RN10  100  [RN-742C083]  (parts A,B,C,D of 4)
U3  MCP6V87  [MSOP-8]  (parts A,B,C of 3)
U4  MCP6V87  [MSOP-8]  (parts A,B,C of 3)
U5  LTC1864 or AD7694  [MSOP-8]
U6  LTC1864 or AD7694  [MSOP-8]
U7  LTC1864 or AD7694  [MSOP-8]
U8  LTC1864 or AD7694  [MSOP-8]
U9  74LVC2G17  [SOT-23-6]  (parts A,B,C of 3)
U10  74LVC2G17  [SOT-23-6]  (parts A,B,C of 3)
U15  LP2985-4.5  [SOT-23-5]
U45  74LVC2T45  [US8-8]

### Ports
CONV-POT3 (in), MISO-P[1..4] (out), POT[1..4] (in), SCLK-POT3 (in), V-POT (out)

### Nets
GND: C1.2(GND) C2.2(GND) C3.2(GND) C4.2(GND) C5.2(GND) C6.2(GND) C7.2(GND) C8.2(GND) C9.2(GND) C11.2(GND) C12.2(GND) C33.2 C34.2(GND) C35.2(GND) C36.2(GND) C37.2(GND) C38.2 C39.2(GND) C40.2(GND) C41.2(GND) C42.2(GND) C43.2(GND) C44.2 C45.2 C103.2(GND) C104.2(GND) RN10.5 RN10.8 U3.4(V-) U4.4(V-) U5.3(IN-) U5.4(GND) U6.3(IN-) U6.4(GND) U7.3(IN-) U7.4(GND) U8.3(IN-) U8.4(GND) U9.2(GND) U10.2(GND) U15.2(GND) U45.4(GND) U45.5(A->B)
VCC: C12.1 C33.1 C35.1 C37.1 C38.1 C40.1 C42.1 C104.1 U3.8(V+) U4.8(V+) U5.8(VCC) U6.8(VCC) U7.8(VCC) U8.8(VCC) U15.1(Vin) U15.3(~{SHDN}) U45.1(VCCA)
VCC3: C44.1 C45.1 C103.1 RN10.6 RN10.7 U9.5(VCC) U10.5(VCC) U45.8(VCCB)
ADC1: C5.1 R9.2 U5.2(IN+)
ADC2: C7.1 R11.2 U7.2(IN+)
ADC3: C6.1 R10.2 U6.2(IN+)
ADC4: C8.1 R12.2 U8.2(IN+)
CONV-POT: R78.2 U5.5(CONV) U6.5(CONV) U7.5(CONV) U8.5(CONV)
CONV-POT3: RN10.1 RN10.2 U45.7(B) ; port CONV-POT3
MISO-P1: U9.4
MISO-P2: U10.4
MISO-P3: U9.6
MISO-P4: U10.6
POT1: R1.1
POT2: R5.1
POT3: R2.1
POT4: R6.1
SCLK-POT: R79.2 U5.7(SCK) U6.7(SCK) U7.7(SCK) U8.7(SCK)
SCLK-POT3: RN10.3 RN10.4 U45.6(B) ; port SCLK-POT3
V-POT: C11.1 C34.1 C36.1 C39.1 C41.1 C43.1 U5.1(REF) U6.1(REF) U7.1(REF) U8.1(REF) U15.5(OUT) ; port V-POT
NetC1_1: C1.1 R3.2 U3.5(IN+)
NetC2_1: C2.1 R4.2 U3.3(IN+)
NetC3_1: C3.1 R7.2 U4.5(IN+)
NetC4_1: C4.1 R8.2 U4.3(IN+)
NetC9_1: C9.1 U15.4(BYP)
NetC27_1: C27.1 R1.2 R3.1
NetC27_2: C27.2 R9.1 U3.6(IN-) U3.7(O)
NetC28_1: C28.1 R2.2 R4.1
NetC28_2: C28.2 R10.1 U3.1(O) U3.2(IN-)
NetC29_1: C29.1 R5.2 R7.1
NetC29_2: C29.2 R11.1 U4.6(IN-) U4.7(O)
NetC30_1: C30.1 R6.2 R8.1
NetC30_2: C30.2 R12.1 U4.1(O) U4.2(IN-)
NetR78_1: R78.1 U45.2(A)
NetR79_1: R79.1 U45.3(A)
NetU5_6: U5.6(SDO) U9.3
NetU6_6: U6.6(SDO) U9.1
NetU7_6: U7.6(SDO) U10.3
NetU8_6: U8.6(SDO) U10.1

### Buses and harness runs
bus MISO-P[1..4] = port MISO-P[1..4]
bus POT[1..4] = port POT[1..4]

### Notes on the sheet
- Potentiometer Interface
- Fc:
- 5 kHz
- Gain:
- Type:
- 1.000
- Butterworth
- 1
- 2
- 3
- 4
- 5
- A
- B
- C
- Drawing Title:
- D
- E
- Sheet:
- Rev:
- F
- Title:
- Computational
- Sensing + Robotics
- L A B O R A T O R Y   F O R
- Part No:
- Print Date:
- THE JOHNS HOPKINS UNIVERSITY
- h t t p : / / l c s r . j h u . e d u
- File Name:
- Sheet
- of

### Library data of the parts
C1-C9 C11 C12 C34-C37 C39-C43 C103 C104 = CAP-GND
C27-C30 = CAP
C33 C38 C44 C45 = CAP-MINI
R1-R12 R78 R79 = R
RN10 = RN-DISC-SM-4X
U3 U4 = OPAMP-DUAL-PWR-MINI
U5-U8 = LTC1864
U9 U10 = 2G17: NC7WZ17
U15 = LP2985

## Sheet S05.SchDoc: Quad Linear Amplifier
size 381 x 254 mm; Revision: 1.6; SheetNumber: 5; SheetTotal: 9
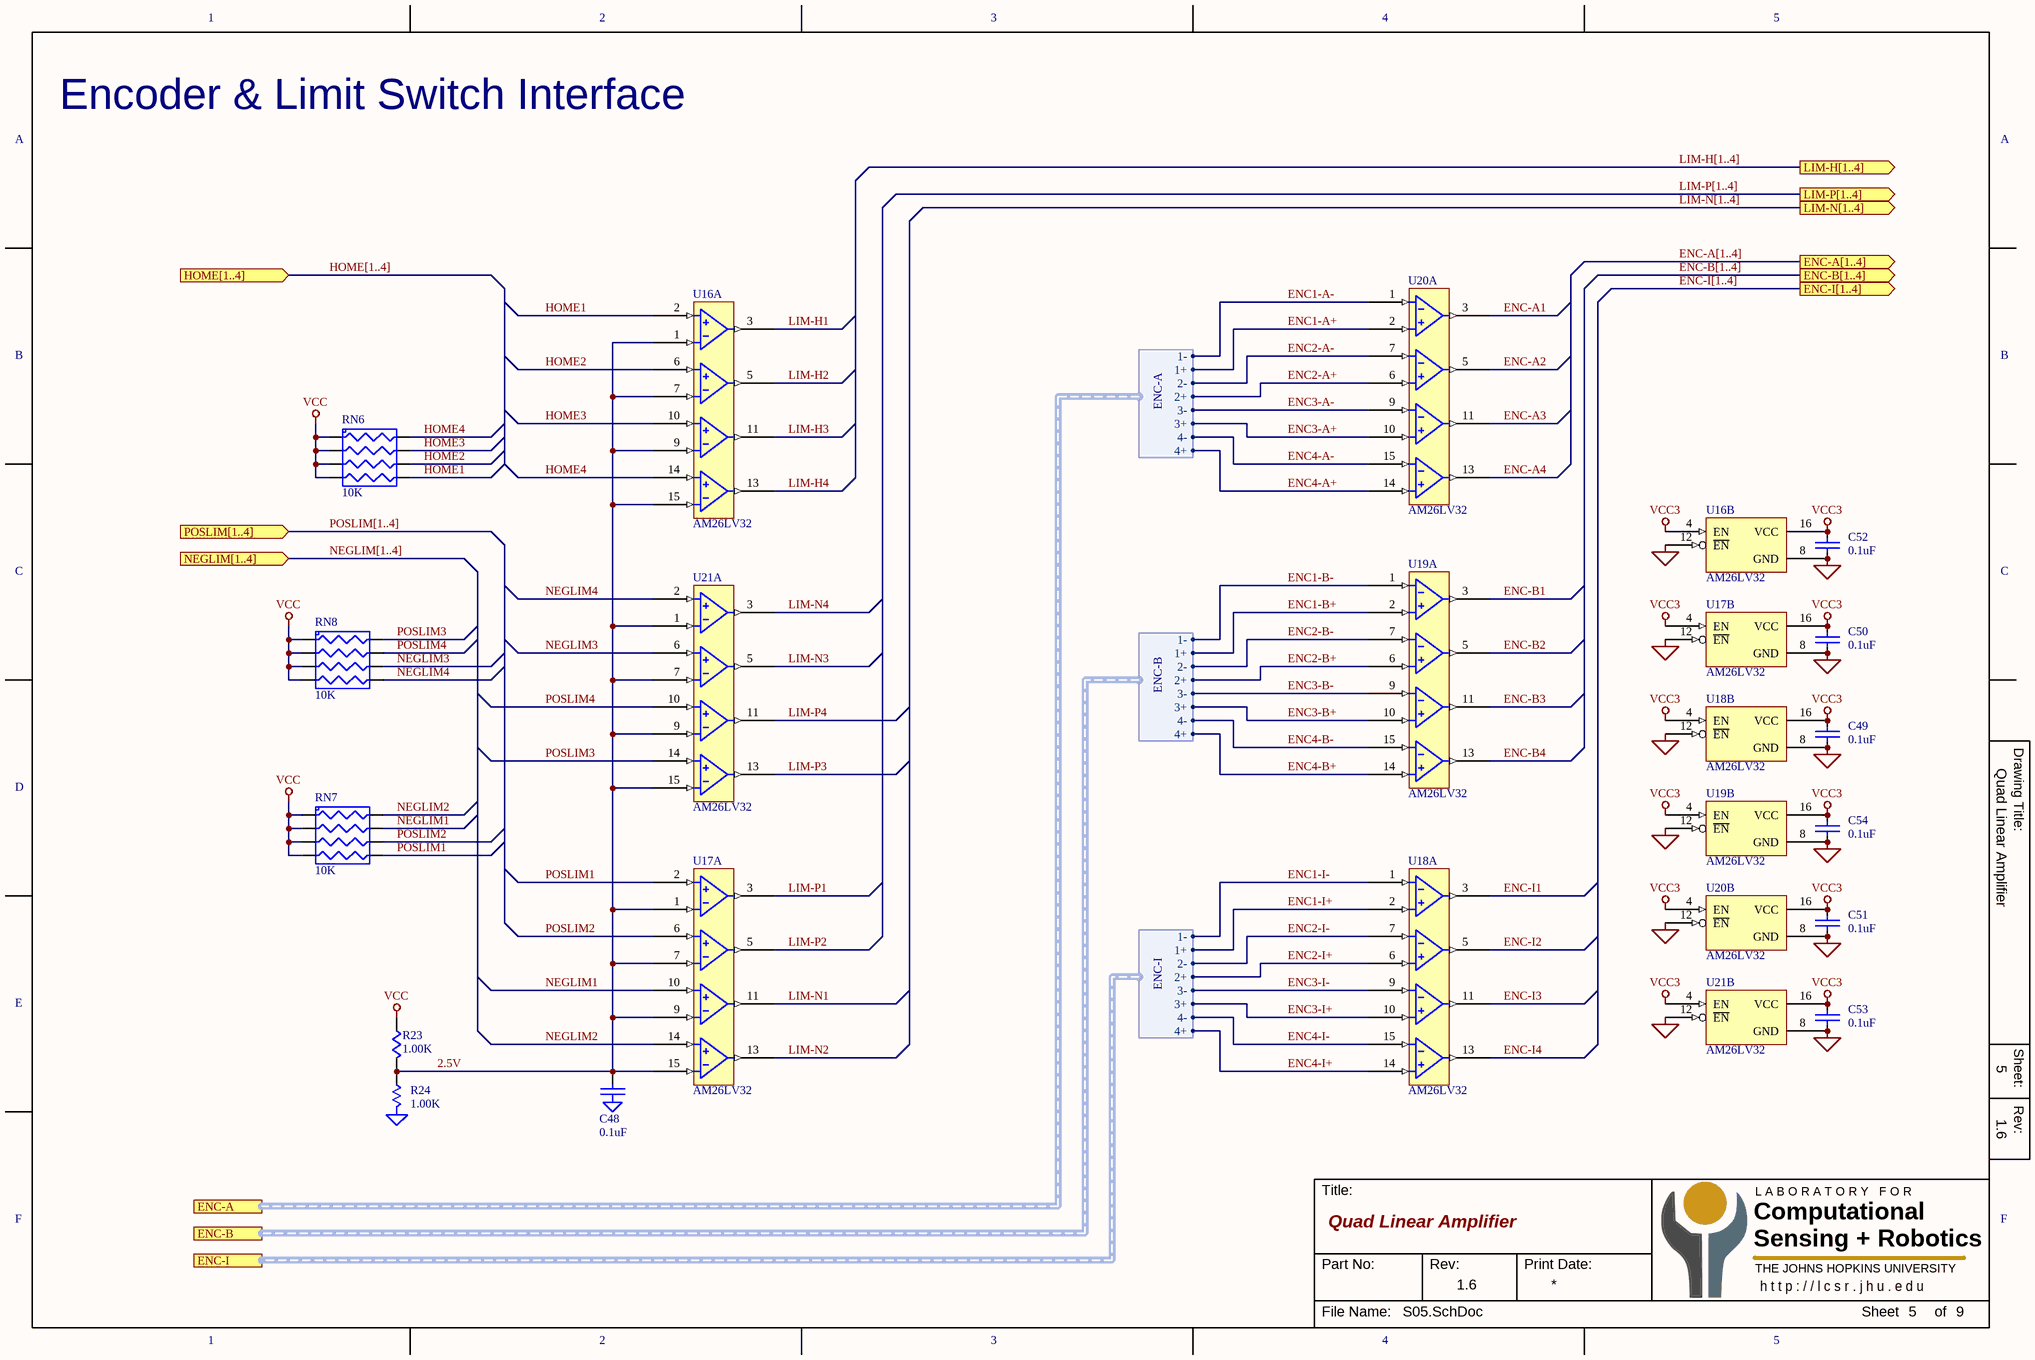
[diagram p4: S05.SchDoc]

### Parts
C48  0.1uF  [C0603]
C49  0.1uF  [C0603]
C50  0.1uF  [C0603]
C51  0.1uF  [C0603]
C52  0.1uF  [C0603]
C53  0.1uF  [C0603]
C54  0.1uF  [C0603]
R23  1.00K  [R0603]
R24  1.00K  [R0603]
RN6  10K  [RN-742C083]
RN7  10K  [RN-742C083]
RN8  10K  [RN-742C083]
U16  AM26LV32  [SO-16]  (parts A,B of 2)
U17  AM26LV32  [SO-16]  (parts A,B of 2)
U18  AM26LV32  [SO-16]  (parts A,B of 2)
U19  AM26LV32  [SO-16]  (parts A,B of 2)
U20  AM26LV32  [SO-16]  (parts A,B of 2)
U21  AM26LV32  [SO-16]  (parts A,B of 2)

### Ports
ENC-A (harness ENC-A), ENC-A[1..4] (out), ENC-B (harness ENC-B), ENC-B[1..4] (out), ENC-I (harness ENC-I), ENC-I[1..4] (out), HOME[1..4] (in), LIM-H[1..4] (out), LIM-N[1..4] (out), LIM-P[1..4] (out), NEGLIM[1..4] (in), POSLIM[1..4] (in)

### Harnesses
ENC-A: 1-, 1+, 2-, 2+, 3-, 3+, 4-, 4+
ENC-B: 1-, 1+, 2-, 2+, 3-, 3+, 4-, 4+
ENC-I: 1-, 1+, 2-, 2+, 3-, 3+, 4-, 4+

### Nets
GND: C48.2(GND) C49.2 C50.2 C51.2 C52.2 C53.2 C54.2 R24.2(GND) U16.8(GND) U16.12(~{EN}) U17.8(GND) U17.12(~{EN}) U18.8(GND) U18.12(~{EN}) U19.8(GND) U19.12(~{EN}) U20.8(GND) U20.12(~{EN}) U21.8(GND) U21.12(~{EN})
VCC: R23.1 RN6.1(R1) RN6.2(R2.1) RN6.3(R3.1) RN6.4(R4.1) RN7.1(R1) RN7.2(R2.1) RN7.3(R3.1) RN7.4(R4.1) RN8.1(R1) RN8.2(R2.1) RN8.3(R3.1) RN8.4(R4.1)
VCC3: C49.1 C50.1 C51.1 C52.1 C53.1 C54.1 U16.4(EN) U16.16(VCC) U17.4(EN) U17.16(VCC) U18.4(EN) U18.16(VCC) U19.4(EN) U19.16(VCC) U20.4(EN) U20.16(VCC) U21.4(EN) U21.16(VCC)
2.5V: C48.1 R23.2 R24.1 U16.1(A-) U16.7(A-) U16.9(A-) U16.15(A-) U17.1(A-) U17.7(A-) U17.9(A-) U17.15(A-) U21.1(A-) U21.7(A-) U21.9(A-) U21.15(A-)
ENC1-A+: U20.2(A+) ; port ENC-A.1+
ENC1-A-: U20.1(A-) ; port ENC-A.1-
ENC1-B+: U19.2(A+) ; port ENC-B.1+
ENC1-B-: U19.1(A-) ; port ENC-B.1-
ENC1-I+: U18.2(A+) ; port ENC-I.1+
ENC1-I-: U18.1(A-) ; port ENC-I.1-
ENC2-A+: U20.6(A+) ; port ENC-A.2+
ENC2-A-: U20.7(A-) ; port ENC-A.2-
ENC2-B+: U19.6(A+) ; port ENC-B.2+
ENC2-B-: U19.7(A-) ; port ENC-B.2-
ENC2-I+: U18.6(A+) ; port ENC-I.2+
ENC2-I-: U18.7(A-) ; port ENC-I.2-
ENC3-A+: U20.10(A+) ; port ENC-A.3+
ENC3-A-: U20.9(A-) ; port ENC-A.3-
ENC3-B+: U19.10(A+) ; port ENC-B.3+
ENC3-B-: U19.9(A-) ; port ENC-B.3-
ENC3-I+: U18.10(A+) ; port ENC-I.3+
ENC3-I-: U18.9(A-) ; port ENC-I.3-
ENC4-A+: U20.14(A+) ; port ENC-A.4+
ENC4-A-: U20.15(A-) ; port ENC-A.4-
ENC4-B+: U19.14(A+) ; port ENC-B.4+
ENC4-B-: U19.15(A-) ; port ENC-B.4-
ENC4-I+: U18.14(A+) ; port ENC-I.4+
ENC4-I-: U18.15(A-) ; port ENC-I.4-
ENC-A1: U20.3(YA)
ENC-A2: U20.5(YA)
ENC-A3: U20.11(YA)
ENC-A4: U20.13(YA)
ENC-B1: U19.3(YA)
ENC-B2: U19.5(YA)
ENC-B3: U19.11(YA)
ENC-B4: U19.13(YA)
ENC-I1: U18.3(YA)
ENC-I2: U18.5(YA)
ENC-I3: U18.11(YA)
ENC-I4: U18.13(YA)
HOME1: RN6.5(R4.2) U16.2(A+)
HOME2: RN6.6(R3.2) U16.6(A+)
HOME3: RN6.7(R2.2) U16.10(A+)
HOME4: RN6.8(R1.2) U16.14(A+)
LIM-H1: U16.3(YA)
LIM-H2: U16.5(YA)
LIM-H3: U16.11(YA)
LIM-H4: U16.13(YA)
LIM-N1: U17.11(YA)
LIM-N2: U17.13(YA)
LIM-N3: U21.5(YA)
LIM-N4: U21.3(YA)
LIM-P1: U17.3(YA)
LIM-P2: U17.5(YA)
LIM-P3: U21.13(YA)
LIM-P4: U21.11(YA)
NEGLIM1: RN7.7(R2.2) U17.10(A+)
NEGLIM2: RN7.8(R1.2) U17.14(A+)
NEGLIM3: RN8.6(R3.2) U21.6(A+)
NEGLIM4: RN8.5(R4.2) U21.2(A+)
POSLIM1: RN7.5(R4.2) U17.2(A+)
POSLIM2: RN7.6(R3.2) U17.6(A+)
POSLIM3: RN8.8(R1.2) U21.14(A+)
POSLIM4: RN8.7(R2.2) U21.10(A+)

### Buses and harness runs
bus ENC-A[1..4] = port ENC-A[1..4]
bus ENC-B[1..4] = port ENC-B[1..4]
bus ENC-I[1..4] = port ENC-I[1..4]
bus HOME[1..4] = port HOME[1..4]
bus LIM-H[1..4] = port LIM-H[1..4]
bus LIM-N[1..4] = port LIM-N[1..4]
bus LIM-P[1..4] = port LIM-P[1..4]
bus NEGLIM[1..4] = port NEGLIM[1..4]
bus POSLIM[1..4] = port POSLIM[1..4]

### Notes on the sheet
- Encoder & Limit Switch Interface
- 1
- 2
- 3
- 4
- 5
- A
- B
- C
- Drawing Title:
- D
- E
- Sheet:
- Rev:
- F
- Title:
- Computational
- Sensing + Robotics
- L A B O R A T O R Y   F O R
- Part No:
- Print Date:
- THE JOHNS HOPKINS UNIVERSITY
- h t t p : / / l c s r . j h u . e d u
- File Name:
- Sheet
- of

### Library data of the parts
C48 = CAP-GND
C49-C54 = CAP-MINI
R23 = R
R24 = R-GND
RN6-RN8 = RN-DISC-SM-4
U16-U21 = DS26LV32AT

## Sheet S06.SchDoc: Quad Linear Amplifier
size 381 x 254 mm; Revision: 1.6; SheetNumber: 6; SheetTotal: 9
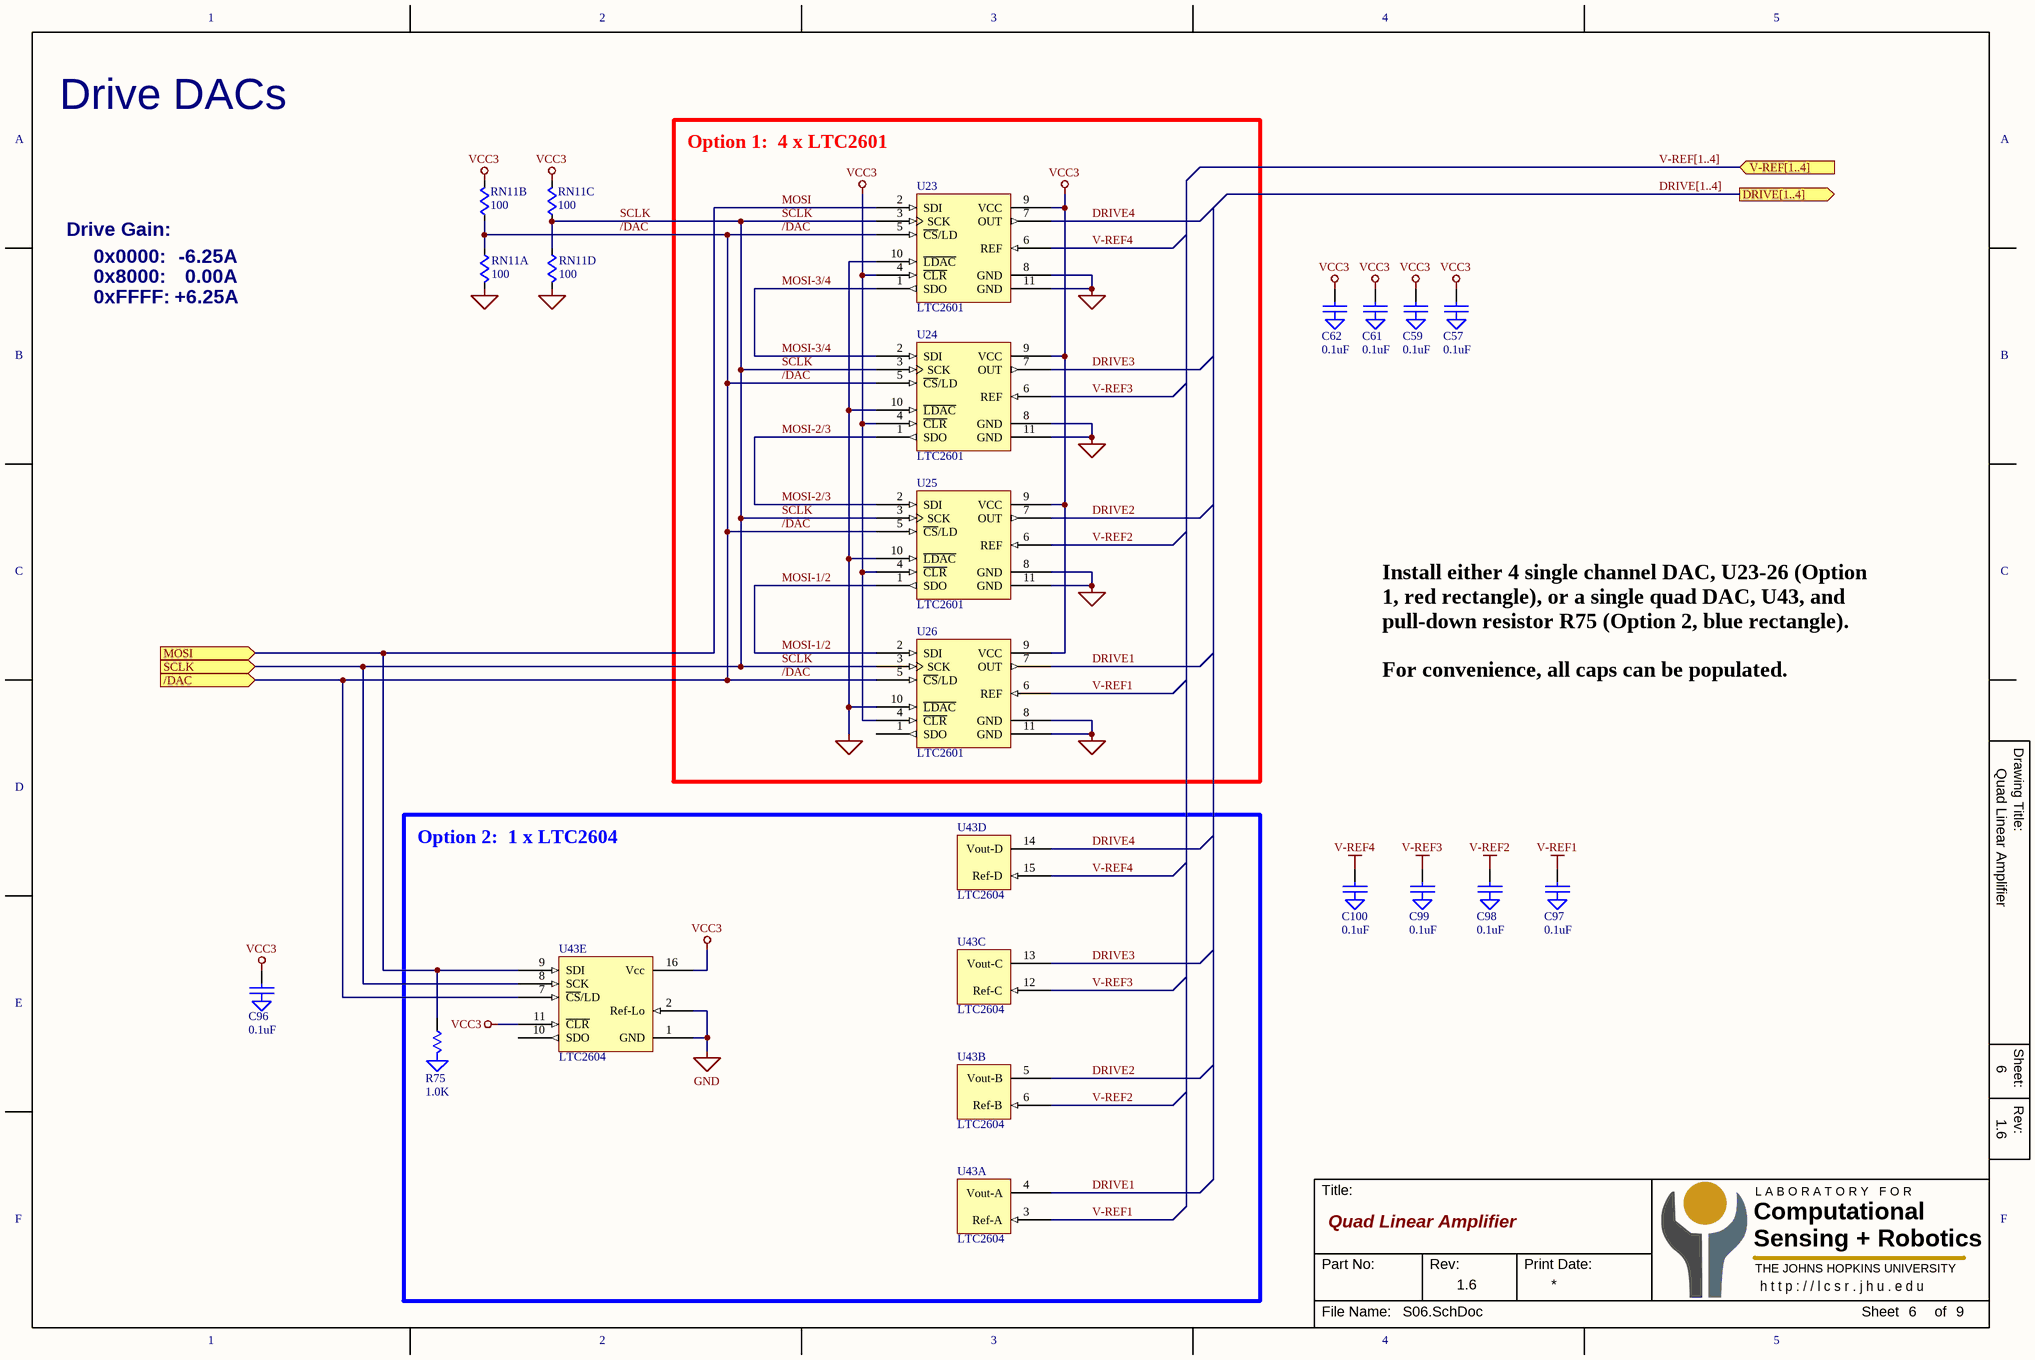
[diagram p5: S06.SchDoc]

### Parts
C57  0.1uF  [C0603]
C59  0.1uF  [C0603]
C61  0.1uF  [C0603]
C62  0.1uF  [C0603]
C96  0.1uF  [C0603]
C97  0.1uF  [C0603]
C98  0.1uF  [C0603]
C99  0.1uF  [C0603]
C100  0.1uF  [C0603]
R75  1.0K  [R0603]
RN11  100  [RN-742C083]  (parts A,B,C,D of 4)
U23  LTC2601  [DFN-10]
U24  LTC2601  [DFN-10]
U25  LTC2601  [DFN-10]
U26  LTC2601  [DFN-10]
U43  LTC2604  [QSOP-16]  (parts A,B,C,D,E of 5)

### Blocks framed on the sheet
Option 1:  4 x LTC2601: U23-U26
Option 2:  1 x LTC2604: R75 U43

### Ports
/DAC (in), DRIVE[1..4] (out), MOSI (in), SCLK (in), V-REF[1..4] (in)

### Nets
GND: C57.2(GND) C59.2(GND) C61.2(GND) C62.2(GND) C96.2(GND) C97.2(GND) C98.2(GND) C99.2(GND) C100.2(GND) R75.2(GND) RN11.5 RN11.8 U23.8(GND) U23.10(~{LDAC}) U23.11(GND) U24.8(GND) U24.10(~{LDAC}) U24.11(GND) U25.8(GND) U25.10(~{LDAC}) U25.11(GND) U26.8(GND) U26.10(~{LDAC}) U26.11(GND) U43.1(GND) U43.2(Ref-Lo)
V-REF1: C97.1 U26.6(REF) U43.3(Ref-A)
V-REF2: C98.1 U25.6(REF) U43.6(Ref-B)
V-REF3: C99.1 U24.6(REF) U43.12(Ref-C)
V-REF4: C100.1 U23.6(REF) U43.15(Ref-D)
VCC3: C57.1 C59.1 C61.1 C62.1 C96.1 RN11.6 RN11.7 U23.4(~{CLR}) U23.9(VCC) U24.4(~{CLR}) U24.9(VCC) U25.4(~{CLR}) U25.9(VCC) U26.4(~{CLR}) U26.9(VCC) U43.11(~{CLR}) U43.16(Vcc)
/DAC: RN11.1 RN11.2 U23.5(~{CS}/LD) U24.5(~{CS}/LD) U25.5(~{CS}/LD) U26.5(~{CS}/LD) U43.7(~{CS}/LD) ; port /DAC
DRIVE1: U26.7(OUT) U43.4(Vout-A)  [project net DRIVE]
DRIVE2: U25.7(OUT) U43.5(Vout-B)  [project net DRIVE]
DRIVE3: U24.7(OUT) U43.13(Vout-C)  [project net DRIVE]
DRIVE4: U23.7(OUT) U43.14(Vout-D)  [project net DRIVE]
MOSI: R75.1 U23.2(SDI) U43.9(SDI) ; port MOSI
MOSI-1/2: U25.1(SDO) U26.2(SDI)
MOSI-2/3: U24.1(SDO) U25.2(SDI)
MOSI-3/4: U23.1(SDO) U24.2(SDI)
SCLK: RN11.3 RN11.4 U23.3(SCK) U24.3(SCK) U25.3(SCK) U26.3(SCK) U43.8(SCK) ; port SCLK

Not connected (* = marked no-connect by the designer): U26 1(SDO); U43 10(SDO)

### Buses and harness runs
bus DRIVE[1..4] = port DRIVE[1..4]
bus V-REF[1..4] = port V-REF[1..4]

### Notes on the sheet
- Drive DACs
- Drive Gain:
- 0x0000:
- 0x8000:
- 0xFFFF:
- +6.25A
- -6.25A
- 0.00A
- Install either 4 single channel DAC, U23-26 (Option 1, red rectangle), or a single quad DAC, U43, and pull-down resistor R75 (Option 2, blue rectangle).
  For convenience, all caps can be populated.
- 1
- 2
- 3
- 4
- 5
- A
- B
- C
- Drawing Title:
- D
- E
- Sheet:
- Rev:
- F
- Title:
- Computational
- Sensing + Robotics
- L A B O R A T O R Y   F O R
- Part No:
- Print Date:
- THE JOHNS HOPKINS UNIVERSITY
- h t t p : / / l c s r . j h u . e d u
- File Name:
- Sheet
- of

### Library data of the parts
C57 C59 C61 C62 C96-C100 = CAP-GND
R75 = R-GND
RN11 = RN-DISC-SM-4X

## Sheet S09.SchDoc: Quad Linear Amplifier
size 381 x 254 mm; Revision: 1.6; SheetNumber: 9; SheetTotal: 9
Used 4 times, as channels U_S091, U_S092, U_S093, U_S094. Parts and nets are listed once, with the designators drawn on the sheet.
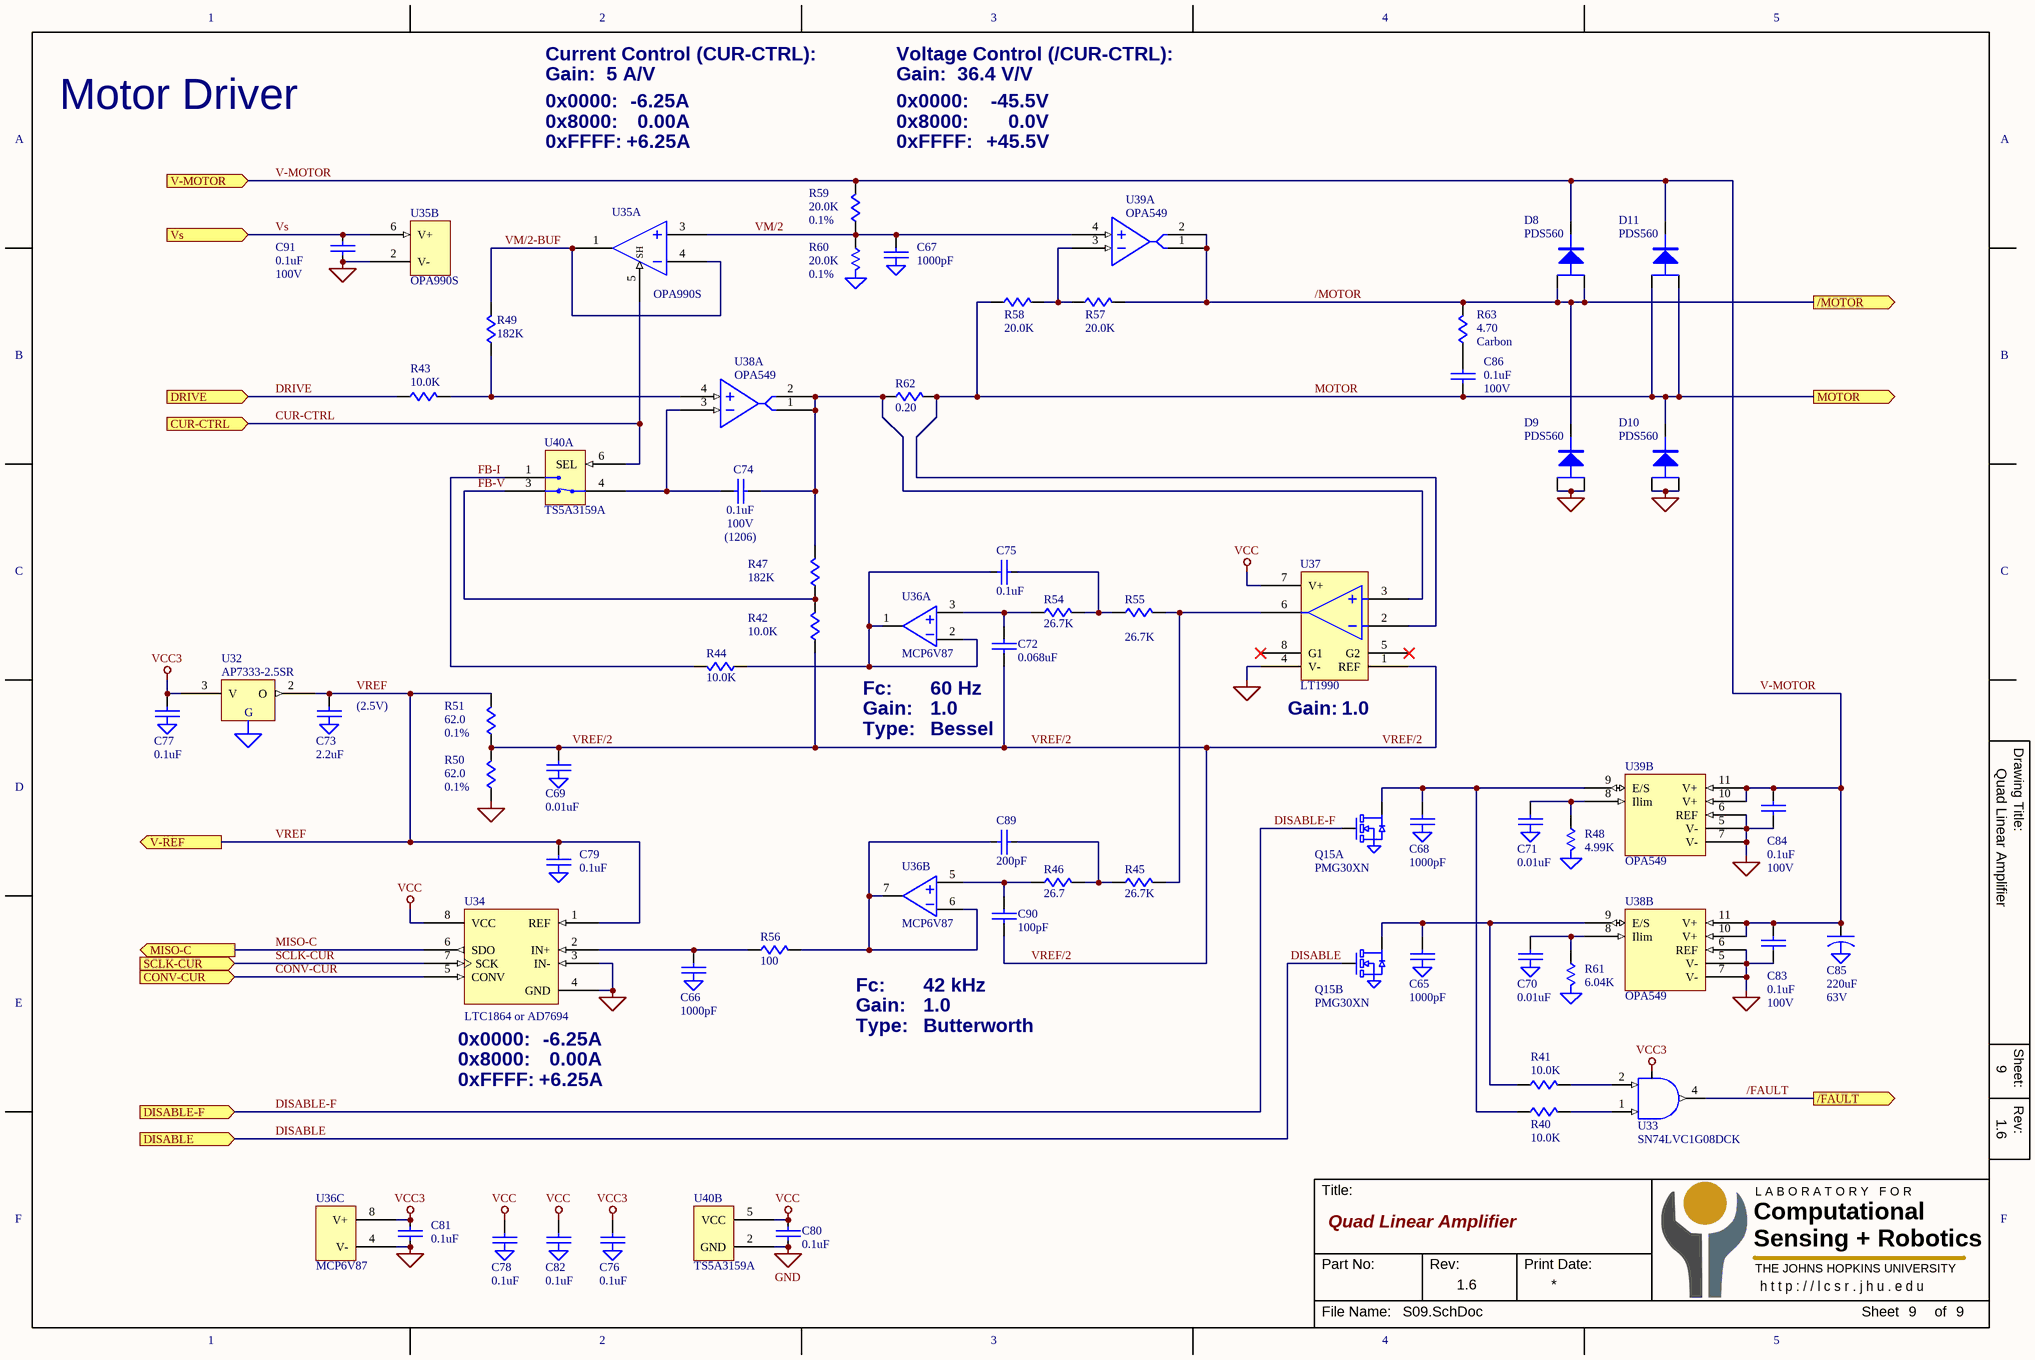
[diagram p6: S09.SchDoc]

### Parts
C65  1000pF  [C0603]
C66  1000pF  [C0603]
C67  1000pF  [C0603]
C68  1000pF  [C0603]
C69  0.01uF  [C0603]
C70  0.01uF  [C0603]
C71  0.01uF  [C0603]
C72  0.068uF  [C0603]
C73  2.2uF  [C0603]
C74  0.1uF  Voltage: 100V  Package: (1206)  [C1206]
C75  0.1uF  [C0603]
C76  0.1uF  [C0603]
C77  0.1uF  [C0603]
C78  0.1uF  [C0603]
C79  0.1uF  [C0603]
C80  0.1uF  [C0603]
C81  0.1uF  [C0603]
C82  0.1uF  [C0603]
C83  0.1uF  Voltage: 100V  [C0805]
C84  0.1uF  Voltage: 100V  [C0805]
C85  220uF  Voltage: 63V  [CAP-10MM]
C86  0.1uF  Voltage: 100V  [C1206]
C89  200pF  [C0603]
C90  100pF  [C0603]
C91  0.1uF  Voltage: 100V  [C0603]
D8  PDS560  [PowerDI-5]
D9  PDS560  [PowerDI-5]
D10  PDS560  [PowerDI-5]
D11  PDS560  [PowerDI-5]
Q15  PMG30XN  [SC70-6]  (parts A,B of 2)
R40  10.0K  [R0603]
R41  10.0K  [R0603]
R42  10.0K  [R0603]
R43  10.0K  [R0603]
R44  10.0K  [R0603]
R45  26.7K  [R0603]
R46  26.7  [R0603]
R47  182K  [R0603]
R48  4.99K  [R0603]
R49  182K  [R0603]
R50  62.0  Tol: 0.1%  [R0603]
R51  62.0  Tol: 0.1%  [R0603]
R54  26.7K  [R0603]
R55  26.7K  [R0603]
R56  100  [R0603]
R57  20.0K  [R0603]
R58  20.0K  [R0603]
R59  20.0K  Tol: 0.1%  [R0603]
R60  20.0K  Tol: 0.1%  [R0603]
R61  6.04K  [R0603]
R62  0.20  [TO-220-2]
R63  4.70  Type: Carbon  [R-1/2W]
U32  AP7333-2.5SR  [SOT-23]
U33  SN74LVC1G08DCK  [SC70-5]
U34  LTC1864 or AD7694  [MSOP-8]
U35  OPA990S  [SOT-23-6]  (parts A,B of 2)
U36  MCP6V87  [MSOP-8]  (parts A,B,C of 3)
U37  LT1990  [SO-8]
U38  OPA549  [POWER-11-T]  (parts A,B of 2)
U39  OPA549  [POWER-11-T]  (parts A,B of 2)
U40  TS5A3159A  [SOT-23-6]  (parts A,B of 2)

### Ports
/FAULT (out), /MOTOR (out), CONV-CUR (in), CUR-CTRL (in), DISABLE (in), DISABLE-F (in), DRIVE (in), MISO-C (out), MOTOR (out), SCLK-CUR (in), V-MOTOR (in), V-REF (out), Vs (in)

### Nets
GND: C65.2(GND) C66.2(GND) C67.2(GND) C68.2(GND) C69.2(GND) C70.2(GND) C71.2(GND) C73.2(GND) C76.2(GND) C77.2(GND) C78.2(GND) C79.2(GND) C80.2 C81.2 C82.2(GND) C83.1 C84.1 C85.2(GND) C91.2 D9.1(A) D9.2(A) D10.1(A) D10.2(A) Q15.1(S1) Q15.4(S2) R48.2(GND) R50.1 R60.2(GND) R61.2(GND) U32.1(GND) U33.3(GND) U34.3(IN-) U34.4(GND) U35.2(V-) U36.4(V-) U37.4(V-) U38.5(V-) U38.6(REF) U38.7(V-) U39.5(V-) U39.6(REF) U39.7(V-) U40.2(GND)
VCC: C78.1 C80.1 C82.1 U34.8(VCC) U37.7(V+) U40.5(VCC)
VCC3: C76.1 C77.1 C81.1 U32.3(V) U33.5(VCC) U36.8(V+)
/FAULT: U33.4 ; port /FAULT
/MOTOR: D8.1(A) D8.2(A) D9.3(C) R57.2 R63.2 U39.1(O) U39.2(O) ; port /MOTOR
CONV-CUR: U34.5(CONV) ; port CONV-CUR
CUR-CTRL: U35.5(SH) U40.6(SEL) ; port CUR-CTRL
DISABLE: Q15.5(G2) ; port DISABLE
DISABLE-F: Q15.2(G1) ; port DISABLE-F
DRIVE: R43.1 ; port DRIVE
FB-I: R44.2 U40.1(NO)
FB-V: R42.1 R47.1 U40.3(NC)
MISO-C: U34.6(SDO) ; port MISO-C
MOTOR: C86.1 D10.3(C) D11.1(A) D11.2(A) R58.1 R62.1 U37.2(IN-) ; port MOTOR
SCLK-CUR: U34.7(SCK) ; port SCLK-CUR
V-MOTOR: C83.2 C84.2 C85.1 D8.3(C) D11.3(C) R59.2 U38.10(V+) U38.11(V+) U39.10(V+) U39.11(V+) ; port V-MOTOR
VM/2: C67.1 R59.1 R60.1 U35.3(IN+) U39.4(IN+)
VM/2-BUF: R49.2 U35.1(O) U35.4(IN-)
VREF: C73.1 C79.1 R51.2 U32.2(O) U34.1(REF) ; port V-REF
VREF/2: C69.1 C72.1 C90.1 R42.2 R50.2 R51.1 U37.1(REF)
Vs: C91.1 U35.6(V+) ; port Vs
NetC65_1: C65.1 Q15.3(D2) R41.1 U38.9(E/S)
NetC66_1: C66.1 R56.2 U34.2(IN+)
NetC68_1: C68.1 Q15.6(D1) R40.1 U39.9(E/S)
NetC70_1: C70.1 R61.1 U38.8(Ilim)
NetC71_1: C71.1 R48.1 U39.8(Ilim)
NetC72_2: C72.2 R54.2 U36.3(IN+)
NetC74_1: C74.1 U38.3(IN-) U40.4(COM)
NetC74_2: C74.2 R47.2 R62.2 U37.3(IN+) U38.1(O) U38.2(O)
NetC75_1: C75.1 R54.1 R55.2
NetC75_2: C75.2 R44.1 U36.1(O) U36.2(IN-)
NetC86_2: C86.2 R63.1
NetC89_1: C89.1 R45.2 R46.1
NetC89_2: C89.2 R56.1 U36.6(IN-) U36.7(O)
NetC90_2: C90.2 R46.2 U36.5(IN+)
NetR40_2: R40.2 U33.1
NetR41_2: R41.2 U33.2
NetR43_2: R43.2 R49.1 U38.4(IN+)
NetR45_1: R45.1 R55.1 U37.6(O)
NetR57_1: R57.1 R58.2 U39.3(IN-)

Not connected (* = marked no-connect by the designer): U37 5(G2)* 8(G1)*

### Channels
U_S091: designators end in A; ports /FAULT=/FAULT /MOTOR=/MOTOR CONV-CUR=CONV-CUR CUR-CTRL=CUR-CTRL_U_S091 DISABLE-F=DISABLE-F_U_S091 DISABLE=DISABLE DRIVE=DRIVE MISO-C=MISO-C MOTOR=MOTOR SCLK-CUR=SCLK-CUR V-MOTOR=V-MOTOR V-REF=V-REF1 Vs=Vs
U_S092: designators end in B; ports /FAULT=/FAULT /MOTOR=/MOTOR CONV-CUR=CONV-CUR CUR-CTRL=CUR-CTRL_U_S092 DISABLE-F=DISABLE-F_U_S092 DISABLE=DISABLE DRIVE=DRIVE MISO-C=MISO-C MOTOR=MOTOR SCLK-CUR=SCLK-CUR V-MOTOR=V-MOTOR V-REF=V-REF2 Vs=Vs
U_S093: designators end in C; ports /FAULT=/FAULT /MOTOR=/MOTOR CONV-CUR=CONV-CUR CUR-CTRL=CUR-CTRL_U_S093 DISABLE-F=DISABLE-F_U_S093 DISABLE=DISABLE DRIVE=DRIVE MISO-C=MISO-C MOTOR=MOTOR SCLK-CUR=SCLK-CUR V-MOTOR=V-MOTOR V-REF=V-REF3 Vs=Vs
U_S094: designators end in D; ports /FAULT=/FAULT /MOTOR=/MOTOR CONV-CUR=CONV-CUR CUR-CTRL=CUR-CTRL_U_S094 DISABLE-F=DISABLE-F_U_S094 DISABLE=DISABLE DRIVE=DRIVE MISO-C=MISO-C MOTOR=MOTOR SCLK-CUR=SCLK-CUR V-MOTOR=V-MOTOR V-REF=V-REF4 Vs=Vs

### Notes on the sheet
- Gain:  5 A/V
- Current Control (CUR-CTRL):
- Voltage Control (/CUR-CTRL):
- Gain:  36.4 V/V
- Motor Driver
- 0x0000:
- 0x8000:
- 0xFFFF:
- +6.25A
- -6.25A
- 0.00A
- +45.5V
- -45.5V
- 0.0V
- (near C73) (2.5V)
- Fc:
- 60 Hz
- Gain:
- Type:
- 1.0
- Bessel
- (near U37) Gain:
- (near U37) 1.0
- 42 kHz
- Butterworth
- (near U34) 0x0000:
- (near U34) -6.25A
- 1
- 2
- 3
- 4
- 5
- A
- B
- C
- Drawing Title:
- D
- E
- Sheet:
- Rev:
- F
- Title:
- Computational
- Sensing + Robotics
- L A B O R A T O R Y   F O R
- Part No:
- Print Date:
- THE JOHNS HOPKINS UNIVERSITY
- h t t p : / / l c s r . j h u . e d u
- File Name:
- Sheet
- of
- (in symbol AP7333R) G

### Library data of the parts
C65-C71 C73 C76-C79 C82 = CAP-GND
C72 C74 C75 C83 C84 C86 C89 C90 = CAP
C80 C81 C91 = CAP-MINI
C85 = CAP-POL-GND
D8-D11 = DIODE-SOT23
Q15 = MOSFET-N-DUAL6
R40-R47 R49-R51 R54-R59 R62 R63 = R
R48 R60 R61 = R-GND
U32 = AP7333R
U33 = 1G08
U34 = LTC1864
U36 = OPAMP-DUAL-PWR-MINI
U40 = TS5A3159

## Sheet S07.SchDoc: Quad Linear Amplifier
size 381 x 254 mm; Revision: 1.6; SheetNumber: 7; SheetTotal: 9
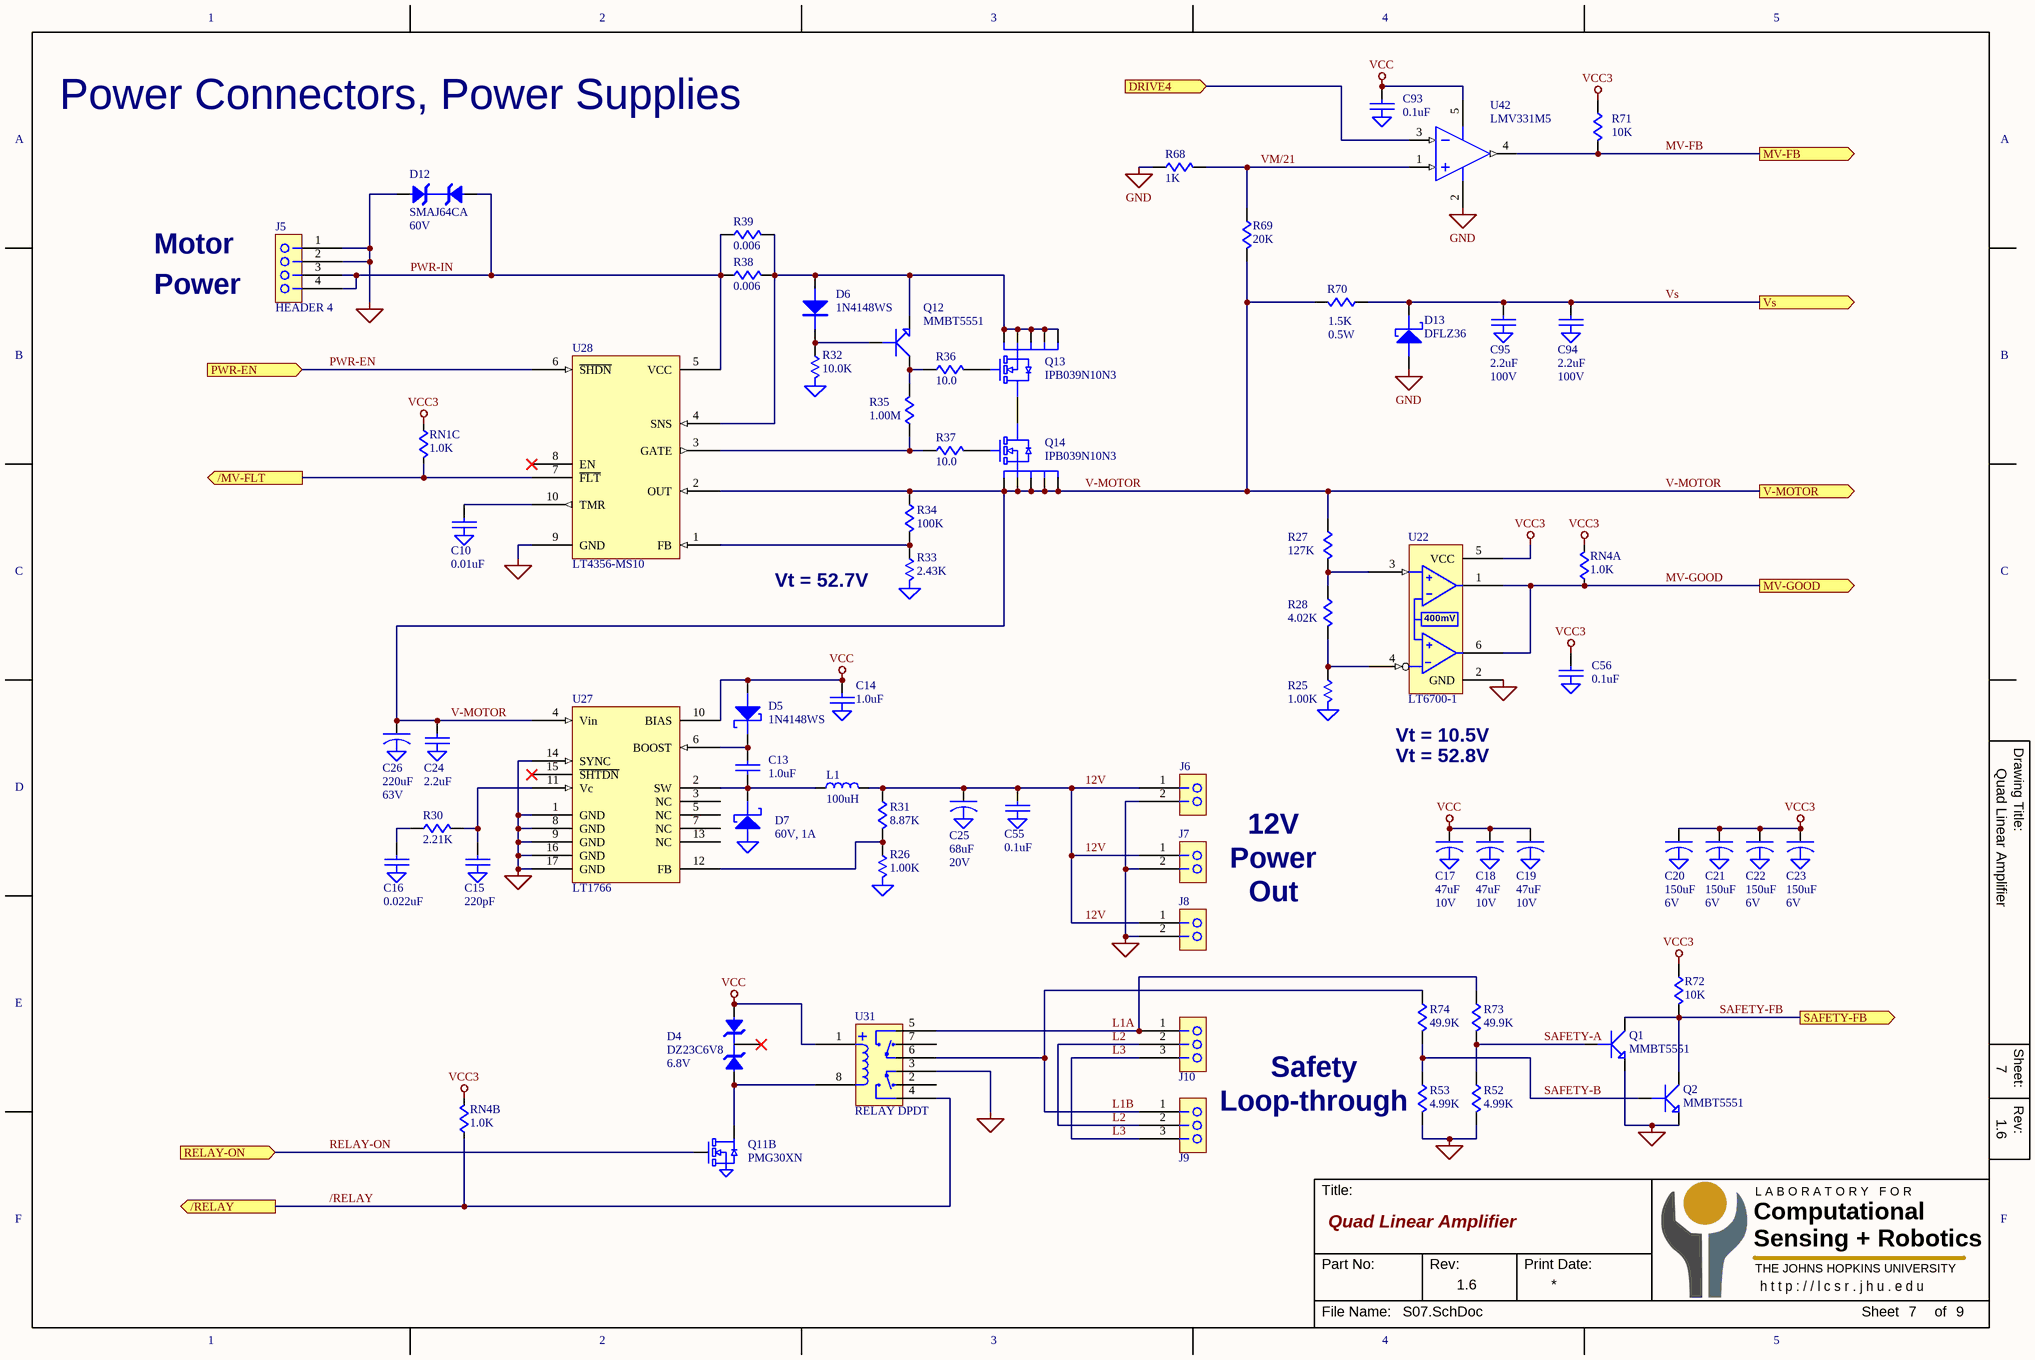
[diagram p7: S07.SchDoc]

### Parts
C10  0.01uF  [C0603]
C13  1.0uF  [C0603]
C14  1.0uF  [C0603]
C15  220pF  [C0603]
C16  0.022uF  [C0603]
C17  47uF  Voltage: 10V  [CAP-B]
C18  47uF  Voltage: 10V  [CAP-B]
C19  47uF  Voltage: 10V  [CAP-B]
C20  150uF  Voltage: 6V  [CAP-B]
C21  150uF  Voltage: 6V  [CAP-B]
C22  150uF  Voltage: 6V  [CAP-B]
C23  150uF  Voltage: 6V  [CAP-B]
C24  2.2uF  [C1206]
C25  68uF  Voltage: 20V  [CAP-D-43]
C26  220uF  Voltage: 63V  [CAP-10MM]
C55  0.1uF  [C0603]
C56  0.1uF  [C0603]
C93  0.1uF  [C0603]
C94  2.2uF  Voltage: 100V  [C1206]
C95  2.2uF  Voltage: 100V  [C1206]
D4  DZ23C6V8  Voltage: 6.8V  [SOT-23]
D5  1N4148WS  [SOD-323]
D6  1N4148WS  [SOD-323]
D7  60V, 1A  [SMP]
D12  SMAJ64CA  Voltage: 60V  [SMA]
D13  DFLZ36  [PowerDI-123]
J5  HEADER 4  [WM-BL381-4]
J6  HEADER 2  [HDR-2x1-100]  (value not drawn)
J7  HEADER 2  [HDR-2x1-100]  (value not drawn)
J8  HEADER 2  [HDR-2x1-100]  (value not drawn)
J9  HEADER 3  [HDR-3x1-100]  (value not drawn)
J10  HEADER 3  [HDR-3x1-100]  (value not drawn)
L1  100uH  [INDUCTOR-DR12x]
Q1  MMBT5551  [SOT-23]
Q2  MMBT5551  [SOT-23]
Q11  PMG30XN  [SC70-6]  (part B of 2)
Q12  MMBT5551  [SOT-23]
Q13  IPB039N10N3  [TO-263-7]
Q14  IPB039N10N3  [TO-263-7]
R25  1.00K  [R0603]
R26  1.00K  [R0603]
R27  127K  [R0603]
R28  4.02K  [R0603]
R30  2.21K  [R0603]
R31  8.87K  [R0603]
R32  10.0K  [R0603]
R33  2.43K  [R0603]
R34  100K  [R0603]
R35  1.00M  [R0603]
R36  10.0  [R0603]
R37  10.0  [R0603]
R38  0.006  [R2512]
R39  0.006  [R2512]
R52  4.99K  [R0603]
R53  4.99K  [R0603]
R68  1K  [R0603]
R69  20K  [R0603]
R70  1.5K  Power: 0.5W  [R0805]
R71  10K  [R0603]
R72  10K  [R0603]
R73  49.9K  [R0603]
R74  49.9K  [R0603]
RN1  1.0K  [RN-742C083]  (part C of 4)
RN4  1.0K  [RN-742C083]  (parts A,B of 4)
U22  LT6700-1  [SOT-23-6]
U27  LT1766  [TSSOP-17]
U28  LT4356-MS10  [MSOP-10]
U31  RELAY DPDT  [RELAY-IM03TS]
U42  LMV331M5  [SOT-23-5]

### Ports
/MV-FLT (out), /RELAY (out), DRIVE4 (in), MV-FB (out), MV-GOOD (out), PWR-EN (in), RELAY-ON (in), SAFETY-FB (out), V-MOTOR (out), Vs (out)

### Nets
GND: C10.2(GND) C14.2(GND) C15.2(GND) C16.2(GND) C17.2(GND) C18.2(GND) C19.2(GND) C20.2(GND) C21.2(GND) C22.2(GND) C23.2(GND) C24.2(GND) C25.2(GND) C26.2(GND) C55.2(GND) C56.2(GND) C93.2(GND) C94.2(GND) C95.2(GND) D7.2(ANODE) D12.2(A1) D13.2(ANODE) J5.1 J5.2 J6.2 J7.2 J8.2 Q1.2(E) Q2.2(E) Q11.4(S2) R25.2(GND) R26.2(GND) R32.2(GND) R33.2(GND) R52.2 R53.2 R68.1 U22.2(GND) U27.1(GND) U27.8(GND) U27.9(GND) U27.14(SYNC) U27.16(GND) U27.17(GND) U28.9(GND) U31.3(COM) U42.2(V-)
VCC: C14.1 C17.1 C18.1 C19.1 C93.1 D4.2(A1) D5.2(ANODE) U27.10(BIAS) U31.1(COIL+) U42.5(V+)
VCC3: C20.1 C21.1 C22.1 C23.1 C56.1 R71.1 R72.1 RN1.3 RN4.7 RN4.8 U22.5(VCC)
12V: C25.1 C55.1 J6.1 J7.1 J8.1 L1.2 R31.1
/MV-FLT: RN1.6 U28.7(~{FLT}) ; port /MV-FLT
/RELAY: RN4.2 U31.4(NO) ; port /RELAY
DRIVE: U42.3(IN-) ; port DRIVE4
L1A: J10.1 R73.1 U31.5(NO)
L1B: J9.1 R74.1 U31.6(COM)
L2: J9.2 J10.2
L3: J9.3 J10.3
MV-FB: R71.2 U42.4(OUT) ; port MV-FB
MV-GOOD: RN4.1 U22.1(OUTA) U22.6(OUTB) ; port MV-GOOD
PWR-EN: U28.6(~{SHDN}) ; port PWR-EN
PWR-IN: D12.1(A2) J5.3 J5.4 R38.1 R39.1 U28.5(VCC)
RELAY-ON: Q11.5(G2) ; port RELAY-ON
SAFETY-A: Q1.1(B) R52.1 R73.2
SAFETY-B: Q2.1(B) R53.1 R74.2
SAFETY-FB: Q1.3(C) Q2.3(C) R72.2 ; port SAFETY-FB
V-MOTOR: C24.1 C26.1 Q14.2(S) Q14.3(S) Q14.5(S) Q14.6(S) Q14.7(S) R27.1 R34.1 R69.2 R70.2 U27.4(Vin) U28.2(OUT) ; port V-MOTOR
VM/21: R68.2 R69.1 U42.1(IN+)
Vs: C94.1 C95.1 D13.1(CATHODE) R70.1 ; port Vs
NetC10_1: C10.1 U28.10(TMR)
NetC13_1: C13.1 D5.1(CATHODE) U27.6(BOOST)
NetC13_2: C13.2 D7.1(CATHODE) L1.1 U27.2(SW)
NetC15_1: C15.1 R30.2 U27.11(Vc)
NetC16_1: C16.1 R30.1
NetD4_1: D4.1(A2) Q11.3(D2) U31.8(COIL-)
NetD6_1: D6.1(C) Q12.1(B) R32.1
NetD6_2: D6.2(A) Q12.2(E) Q13.2(S) Q13.3(S) Q13.5(S) Q13.6(S) Q13.7(S) R38.2 R39.2 U28.4(SNS)
NetQ12_3: Q12.3(C) R35.2 R36.1
NetQ13_1: Q13.1(G) R36.2
NetQ13_4: Q13.4(D) Q14.4(D)
NetQ14_1: Q14.1(G) R37.2
NetR25_1: R25.1 R28.2 U22.4(INB)
NetR26_1: R26.1 R31.2 U27.12(FB)
NetR27_2: R27.2 R28.1 U22.3(INA)
NetR33_1: R33.1 R34.2 U28.1(FB)
NetR35_1: R35.1 R37.1 U28.3(GATE)

Not connected (* = marked no-connect by the designer): D4 3(A1)*; U27 3(NC) 5(NC) 7(NC) 13(NC) 15(~{SHTDN})*; U28 8(EN)*; U31 2(NC) 7(NC)

### Notes on the sheet
- Power Connectors, Power Supplies
- Motor
- Power
- Vt = 52.7V
- (near U22) Vt = 10.5V
- Vt = 52.8V
- 12V
- Out
- Safety
- (near R53) Loop-through
- SAFETY1-FB is high when L1A > 4.5V.  Voltage at L1A must be less than 52.8V
- 1
- 2
- 3
- 4
- 5
- A
- B
- C
- Drawing Title:
- D
- E
- Sheet:
- Rev:
- F
- Title:
- Computational
- Sensing + Robotics
- L A B O R A T O R Y   F O R
- Part No:
- Print Date:
- THE JOHNS HOPKINS UNIVERSITY
- h t t p : / / l c s r . j h u . e d u
- File Name:
- Sheet
- of
- (in symbol LT6700-SOT) 400mV

### Library data of the parts
C10 C14-C16 C24 C55 C56 C93-C95 = CAP-GND
C13 = CAP
C17-C23 C25 C26 = CAP-POL-GND
D4 = ZENER-DUAL-CC
D5 D6 D13 = DIODE
D7 = DIODE GND/A
D12 = ZENER-DUAL-TVS
L1 = INDUCTOR-MINI
Q1 Q2 Q12 = NPN-SM
Q11 = MOSFET-N-DUAL6
Q13 Q14 = MOSFET-N-TO263-7
R25 R26 R32 R33 = R-GND
R27 R28 R30 R31 R34-R39 R52 R53 R68-R74 = R
RN1 RN4 = RN-DISC-SM-4X
U22 = LT6700-SOT
U42 = LMV331: Comparator, SOT-23-5

## Sheet S08.SchDoc: Quad Linear Amplifier
size 381 x 254 mm; Revision: 1.6; SheetNumber: 8; SheetTotal: 9
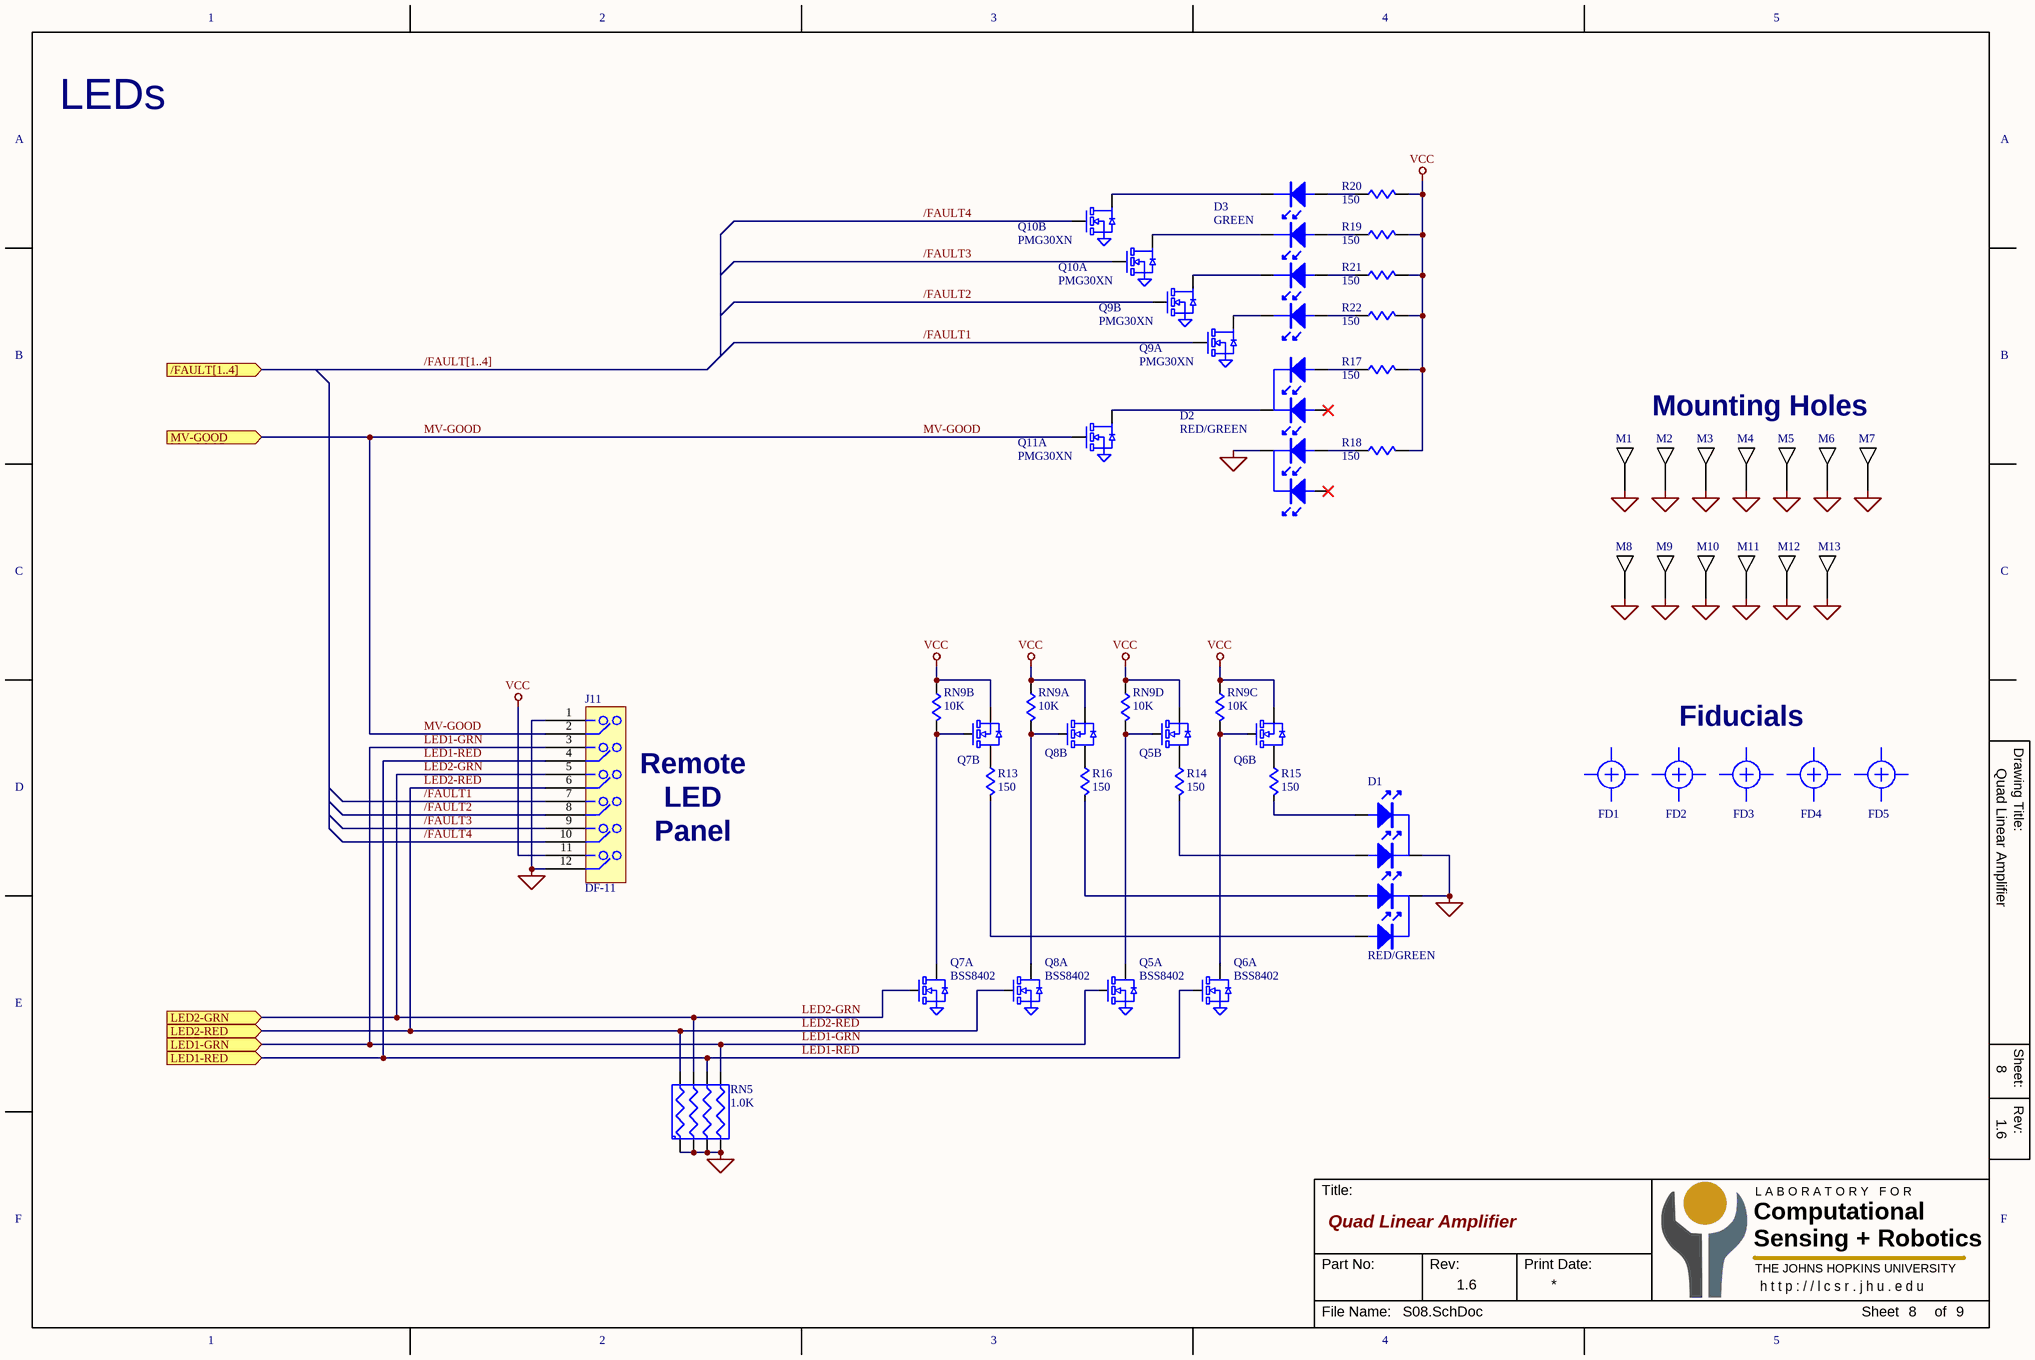
[diagram p8: S08.SchDoc]

### Parts
D1  RED/GREEN  [LED-3MM-2C-DUAL]
D2  RED/GREEN  [LED-3MM-2C-DUAL]
D3  GREEN  [LED-3MM-QUAD]
FD1  FD  [FD]  (value not drawn)  (no BOM)
FD2  FD  [FD]  (value not drawn)  (no BOM)
FD3  FD  [FD]  (value not drawn)  (no BOM)
FD4  FD  [FD]  (value not drawn)  (no BOM)
FD5  FD  [FD]  (value not drawn)  (no BOM)
J11  DF-11  [HDR-6x2-2MM]
M1  MHOLE  [MHOLE4]  (value not drawn)  (no BOM)
M2  MHOLE  [MHOLE4]  (value not drawn)  (no BOM)
M3  MHOLE  [MHOLE4]  (value not drawn)  (no BOM)
M4  MHOLE  [MHOLE4]  (value not drawn)  (no BOM)
M5  MHOLE  [MHOLE4]  (value not drawn)  (no BOM)
M6  MHOLE  [MHOLE4]  (value not drawn)  (no BOM)
M7  MHOLE  [MHOLE4]  (value not drawn)  (no BOM)
M8  MHOLE  [MHOLE4]  (value not drawn)  (no BOM)
M9  MHOLE  [MHOLE4]  (value not drawn)  (no BOM)
M10  MHOLE  [MHOLE4]  (value not drawn)  (no BOM)
M11  MHOLE  [MHOLE4]  (value not drawn)  (no BOM)
M12  MHOLE  [MHOLE4]  (value not drawn)  (no BOM)
M13  MHOLE  [MHOLE4]  (value not drawn)  (no BOM)
Q5  BSS8402  [SC70-6]  (parts A,B of 2)
Q6  BSS8402  [SC70-6]  (parts A,B of 2)
Q7  BSS8402  [SC70-6]  (parts A,B of 2)
Q8  BSS8402  [SC70-6]  (parts A,B of 2)
Q9  PMG30XN  [SC70-6]  (parts A,B of 2)
Q10  PMG30XN  [SC70-6]  (parts A,B of 2)
Q11  PMG30XN  [SC70-6]  (part A of 2)
R13  150  [R0603]
R14  150  [R0603]
R15  150  [R0603]
R16  150  [R0603]
R17  150  [R0603]
R18  150  [R0603]
R19  150  [R0603]
R20  150  [R0603]
R21  150  [R0603]
R22  150  [R0603]
RN5  1.0K  [RN-742C083]
RN9  10K  [RN-742C083]  (parts A,B,C,D of 4)

### Ports
/FAULT[1..4] (in), LED1-GRN (in), LED1-RED (in), LED2-GRN (in), LED2-RED (in), MV-GOOD (in)

### Nets
GND: D1.2(C) D1.5(C) D2.2(C) J11.1 J11.12 M1.1 M2.1 M3.1 M4.1 M5.1 M6.1 M7.1 M8.1 M9.1 M10.1 M11.1 M12.1 M13.1 Q5.1(S1) Q6.1(S1) Q7.1(S1) Q8.1(S1) Q9.1(S1) Q9.4(S2) Q10.1(S1) Q10.4(S2) Q11.1(S1) RN5.1(R1) RN5.2(R2.1) RN5.3(R3.1) RN5.4(R4.1)
VCC: J11.11 Q5.4(S2) Q6.4(S2) Q7.4(S2) Q8.4(S2) R17.2 R18.2 R19.2 R20.2 R21.2 R22.2 RN9.1 RN9.2 RN9.3 RN9.4
/FAULT1: J11.7 Q9.2(G1)  [project net /FAULT]
/FAULT2: J11.8 Q9.5(G2)  [project net /FAULT]
/FAULT3: J11.9 Q10.2(G1)  [project net /FAULT]
/FAULT4: J11.10 Q10.5(G2)  [project net /FAULT]
LED1-GRN: J11.3 Q5.2(G1) RN5.5(R4.2) ; port LED1-GRN
LED1-RED: J11.4 Q6.2(G1) RN5.6(R3.2) ; port LED1-RED
LED2-GRN: J11.5 Q7.2(G1) RN5.7(R2.2) ; port LED2-GRN
LED2-RED: J11.6 Q8.2(G1) RN5.8(R1.2) ; port LED2-RED
MV-GOOD: J11.2 Q11.2(G1) ; port MV-GOOD
NetD1_1: D1.1(A) R15.2
NetD1_3: D1.3(A) R14.2
NetD1_4: D1.4(A) R16.2
NetD1_6: D1.6(A) R13.2
NetD2_3: D2.3(A) R18.1
NetD2_5: D2.5(C) Q11.6(D1)
NetD2_6: D2.6(A) R17.1
NetD3_1: D3.1(C) Q9.6(D1)
NetD3_2: D3.2(A) R22.1
NetD3_3: D3.3(C) Q9.3(D2)
NetD3_4: D3.4(A) R21.1
NetD3_5: D3.5(C) Q10.6(D1)
NetD3_6: D3.6(A) R19.1
NetD3_7: D3.7(C) Q10.3(D2)
NetD3_8: D3.8(A) R20.1
NetQ5_3: Q5.3(D2) R14.1
NetQ5_5: Q5.5(G2) Q5.6(D1) RN9.5
NetQ6_3: Q6.3(D2) R15.1
NetQ6_5: Q6.5(G2) Q6.6(D1) RN9.6
NetQ7_3: Q7.3(D2) R13.1
NetQ7_5: Q7.5(G2) Q7.6(D1) RN9.7
NetQ8_3: Q8.3(D2) R16.1
NetQ8_5: Q8.5(G2) Q8.6(D1) RN9.8

Not connected (* = marked no-connect by the designer): D2 1(A)* 4(A)*

### Buses and harness runs
bus /FAULT[1..4] = port /FAULT[1..4]

### Notes on the sheet
- LEDs
- Mounting Holes
- Fiducials
- Panel
- Remote
- LED
- 1
- 2
- 3
- 4
- 5
- A
- B
- C
- Drawing Title:
- D
- E
- Sheet:
- Rev:
- F
- Title:
- Computational
- Sensing + Robotics
- L A B O R A T O R Y   F O R
- Part No:
- Print Date:
- THE JOHNS HOPKINS UNIVERSITY
- h t t p : / / l c s r . j h u . e d u
- File Name:
- Sheet
- of

### Library data of the parts
D1 D2 = LED-DUAL-2C
D3 = LED-QUAD
J11 = HEADER 6X2-1
M1-M13 = MHOLE: Mounting Hole
Q5-Q8 = MOSFET-N/P-6
Q9-Q11 = MOSFET-N-DUAL6
R13-R16 = R-MINI
R17-R22 = R
RN5 = RN-DISC-SM-4
RN9 = RN-DISC-SM-4X

## Nets that join several sheets
GND: S02 (43 pins), S03 (39 pins), S04 (43 pins), S05 (20 pins), S06 (26 pins), U_S091 (43 pins), U_S092 (43 pins), U_S093 (43 pins), U_S094 (43 pins), S07 (47 pins), S08 (31 pins)
V-REF1: S06 (C97.1 U26.6 U43.3), U_S091 (5 pins)
V-REF2: S06 (C98.1 U25.6 U43.6), U_S092 (5 pins)
V-REF3: S06 (C99.1 U24.6 U43.12), U_S093 (5 pins)
V-REF4: S06 (C100.1 U23.6 U43.15), U_S094 (5 pins)
VCC: S02 (C102.1 J1.41 J1.42 U44.1), S03 (6 pins), S04 (17 pins), S05 (13 pins), U_S091 (6 pins), U_S092 (6 pins), U_S093 (6 pins), U_S094 (6 pins), S07 (10 pins), S08 (15 pins)
VCC3: S02 (30 pins), S03 (5 pins), S04 (8 pins), S05 (18 pins), S06 (17 pins), U_S091 (6 pins), U_S092 (6 pins), U_S093 (6 pins), U_S094 (6 pins), S07 (11 pins)
/DAC: S02 (J1.25), S06 (7 pins)
/FAULT: S02 (J2.35), U_S091 (U33A.4), S08 (J11.7 Q9.2)
/FAULT: S02 (J2.37), U_S092 (U33B.4), S08 (J11.8 Q9.5)
/FAULT: S02 (J2.39), U_S093 (U33C.4), S08 (J11.9 Q10.2)
/FAULT: S02 (J2.41), U_S094 (U33D.4), S08 (J11.10 Q10.5)
/MOTOR: S03 (J4.6), U_S091 (7 pins)
/MOTOR: S03 (J4.7), U_S092 (7 pins)
/MOTOR: S03 (J4.8), U_S093 (7 pins)
/MOTOR: S03 (J4.9), U_S094 (7 pins)
/MV-FLT: S02 (J1.9), S07 (RN1.6 U28.7)
/RELAY: S02 (J2.11), S07 (RN4.2 U31.4)
/V-FAULT: S02 (J1.11), S03 (R29.2 U2.5 U2.8)
CONV-CUR: S02 (R76.2), U_S091 (U34A.5), U_S092 (U34B.5), U_S093 (U34C.5), U_S094 (U34D.5)
CONV-POT3: S02 (J1.13), S04 (RN10.1 RN10.2 U45.7)
DIR12: S02 (J1.8), S03 (RN4.6 U11.5)
DIR34: S02 (J1.7), S03 (RN4.5 U12.5)
DISABLE: S02 (J2.36 RN3.8), U_S091 (Q15A.5)
DISABLE: S02 (J2.38 RN3.7), U_S092 (Q15B.5)
DISABLE: S02 (J2.40 RN3.6), U_S093 (Q15C.5)
DISABLE: S02 (J2.42 RN3.5), U_S094 (Q15D.5)
DRIVE: S06 (U26.7 U43.4), U_S091 (R43A.1)
DRIVE: S06 (U25.7 U43.5), U_S092 (R43B.1)
DRIVE: S06 (U24.7 U43.13), U_S093 (R43C.1)
DRIVE: S06 (U23.7 U43.14), U_S094 (R43D.1), S07 (U42.3)
ENC1-A+: S03 (J3.39), S05 (U20.2)
ENC1-A-: S03 (J3.5), S05 (U20.1)
ENC1-B+: S03 (J3.47), S05 (U19.2)
ENC1-B-: S03 (J3.13), S05 (U19.1)
ENC1-I+: S03 (J3.53), S05 (U18.2)
ENC1-I-: S03 (J3.19), S05 (U18.1)
ENC2-A+: S03 (J3.40), S05 (U20.6)
ENC2-A-: S03 (J3.6), S05 (U20.7)
ENC2-B+: S03 (J3.48), S05 (U19.6)
ENC2-B-: S03 (J3.14), S05 (U19.7)
ENC2-I+: S03 (J3.54), S05 (U18.6)
ENC2-I-: S03 (J3.20), S05 (U18.7)
ENC3-A+: S03 (J3.41), S05 (U20.10)
ENC3-A-: S03 (J3.7), S05 (U20.9)
ENC3-B+: S03 (J3.49), S05 (U19.10)
ENC3-B-: S03 (J3.15), S05 (U19.9)
ENC3-I+: S03 (J3.55), S05 (U18.10)
ENC3-I-: S03 (J3.21), S05 (U18.9)
ENC4-A+: S03 (J3.42), S05 (U20.14)
ENC4-A-: S03 (J3.8), S05 (U20.15)
ENC4-B+: S03 (J3.50), S05 (U19.14)
ENC4-B-: S03 (J3.16), S05 (U19.15)
ENC4-I+: S03 (J3.56), S05 (U18.14)
ENC4-I-: S03 (J3.22), S05 (U18.15)
ENC-A1: S02 (J2.26), S05 (U20.3)
ENC-A2: S02 (J2.24), S05 (U20.5)
ENC-A3: S02 (J2.22), S05 (U20.11)
ENC-A4: S02 (J2.20), S05 (U20.13)
ENC-B1: S02 (J2.18), S05 (U19.3)
ENC-B2: S02 (J2.16), S05 (U19.5)
ENC-B3: S02 (J2.14), S05 (U19.11)
ENC-B4: S02 (J2.12), S05 (U19.13)
ENC-I1: S02 (J2.10), S05 (U18.3)
ENC-I2: S02 (J2.8), S05 (U18.5)
ENC-I3: S02 (J2.6), S05 (U18.11)
ENC-I4: S02 (J2.4), S05 (U18.13)
HOME1: S03 (J3.17), S05 (RN6.5 U16.2)
HOME2: S03 (J3.18), S05 (RN6.6 U16.6)
HOME3: S03 (J3.51), S05 (RN6.7 U16.10)
HOME4: S03 (J3.52), S05 (RN6.8 U16.14)
LED1-GRN: S02 (J2.3), S08 (J11.3 Q5.2 RN5.5)
LED1-RED: S02 (J2.5), S08 (J11.4 Q6.2 RN5.6)
LED2-GRN: S02 (J2.7), S08 (J11.5 Q7.2 RN5.7)
LED2-RED: S02 (J2.9), S08 (J11.6 Q8.2 RN5.8)
LIM-H1: S02 (J2.17), S05 (U16.3)
LIM-H2: S02 (J2.19), S05 (U16.5)
LIM-H3: S02 (J2.21), S05 (U16.11)
LIM-H4: S02 (J2.23), S05 (U16.13)
LIM-N1: S02 (J2.25), S05 (U17.11)
LIM-N2: S02 (J2.28), S05 (U17.13)
LIM-N3: S02 (J2.27), S05 (U21.5)
LIM-N4: S02 (J2.30), S05 (U21.3)
LIM-P1: S02 (J2.31), S05 (U17.3)
LIM-P2: S02 (J2.32), S05 (U17.5)
LIM-P3: S02 (J2.33), S05 (U21.13)
LIM-P4: S02 (J2.34), S05 (U21.11)
MISO-C: S02 (U13.1), U_S092 (U34B.6)
MISO-C: S02 (U13.3), U_S091 (U34A.6)
MISO-C: S02 (U14.1), U_S094 (U34D.6)
MISO-C: S02 (U14.3), U_S093 (U34C.6)
MISO-P1: S02 (J1.18), S04 (U9.4)
MISO-P2: S02 (J1.17), S04 (U10.4)
MISO-P3: S02 (J1.16), S04 (U9.6)
MISO-P4: S02 (J1.15), S04 (U10.6)
MOSI: S02 (J1.23), S06 (R75.1 U23.2 U43.9)
MOTOR: S03 (J4.1), U_S091 (7 pins)
MOTOR: S03 (J4.2), U_S092 (7 pins)
MOTOR: S03 (J4.3), U_S093 (7 pins)
MOTOR: S03 (J4.4), U_S094 (7 pins)
MV-FB: S02 (U41.13), S07 (R71.2 U42.4)
MV-GOOD: S02 (J2.13), S07 (RN4.1 U22.1 U22.6), S08 (J11.2 Q11.2)
NEGLIM1: S03 (J3.11), S05 (RN7.7 U17.10)
NEGLIM2: S03 (J3.12), S05 (RN7.8 U17.14)
NEGLIM3: S03 (J3.45), S05 (RN8.6 U21.6)
NEGLIM4: S03 (J3.46), S05 (RN8.5 U21.2)
OUT1: S02 (J1.22), S03 (RN2.1 RN13.8)
OUT2: S02 (J1.21), S03 (RN2.2 RN13.7)
OUT3: S02 (J1.20), S03 (RN2.3 RN13.6)
OUT4: S02 (J1.19), S03 (RN2.4 RN13.5)
POSLIM1: S03 (J3.9), S05 (RN7.5 U17.2)
POSLIM2: S03 (J3.10), S05 (RN7.6 U17.6)
POSLIM3: S03 (J3.43), S05 (RN8.8 U21.14)
POSLIM4: S03 (J3.44), S05 (RN8.7 U21.10)
POT1: S03 (J3.35), S04 (R1.1)
POT2: S03 (J3.2), S04 (R5.1)
POT3: S03 (J3.37), S04 (R2.1)
POT4: S03 (J3.4), S04 (R6.1)
PWR-EN: S02 (J1.36 RN1.7), S07 (U28.6)
RELAY-ON: S02 (J1.35 RN1.8), S07 (Q11.5)
SAFETY-FB: S02 (U41.12), S07 (Q1.3 Q2.3 R72.2)
SCLK: S02 (J1.24), S06 (7 pins)
SCLK-CUR: S02 (R77.2), U_S091 (U34A.7), U_S092 (U34B.7), U_S093 (U34C.7), U_S094 (U34D.7)
SCLK-POT3: S02 (J1.12), S04 (RN10.3 RN10.4 U45.6)
V-MOTOR: U_S091 (10 pins), U_S092 (10 pins), U_S093 (10 pins), U_S094 (10 pins), S07 (13 pins)
V-POT: S03 (J3.31 J3.32 J3.33), S04 (11 pins)
Vs: U_S091 (C91A.1 U35A.6), U_S092 (C91B.1 U35B.6), U_S093 (C91C.1 U35C.6), U_S094 (C91D.1 U35D.6), S07 (C94.1 C95.1 D13.1 R70.1)